# EAGLE design monitor_3 (EAGLE 7.2.0)
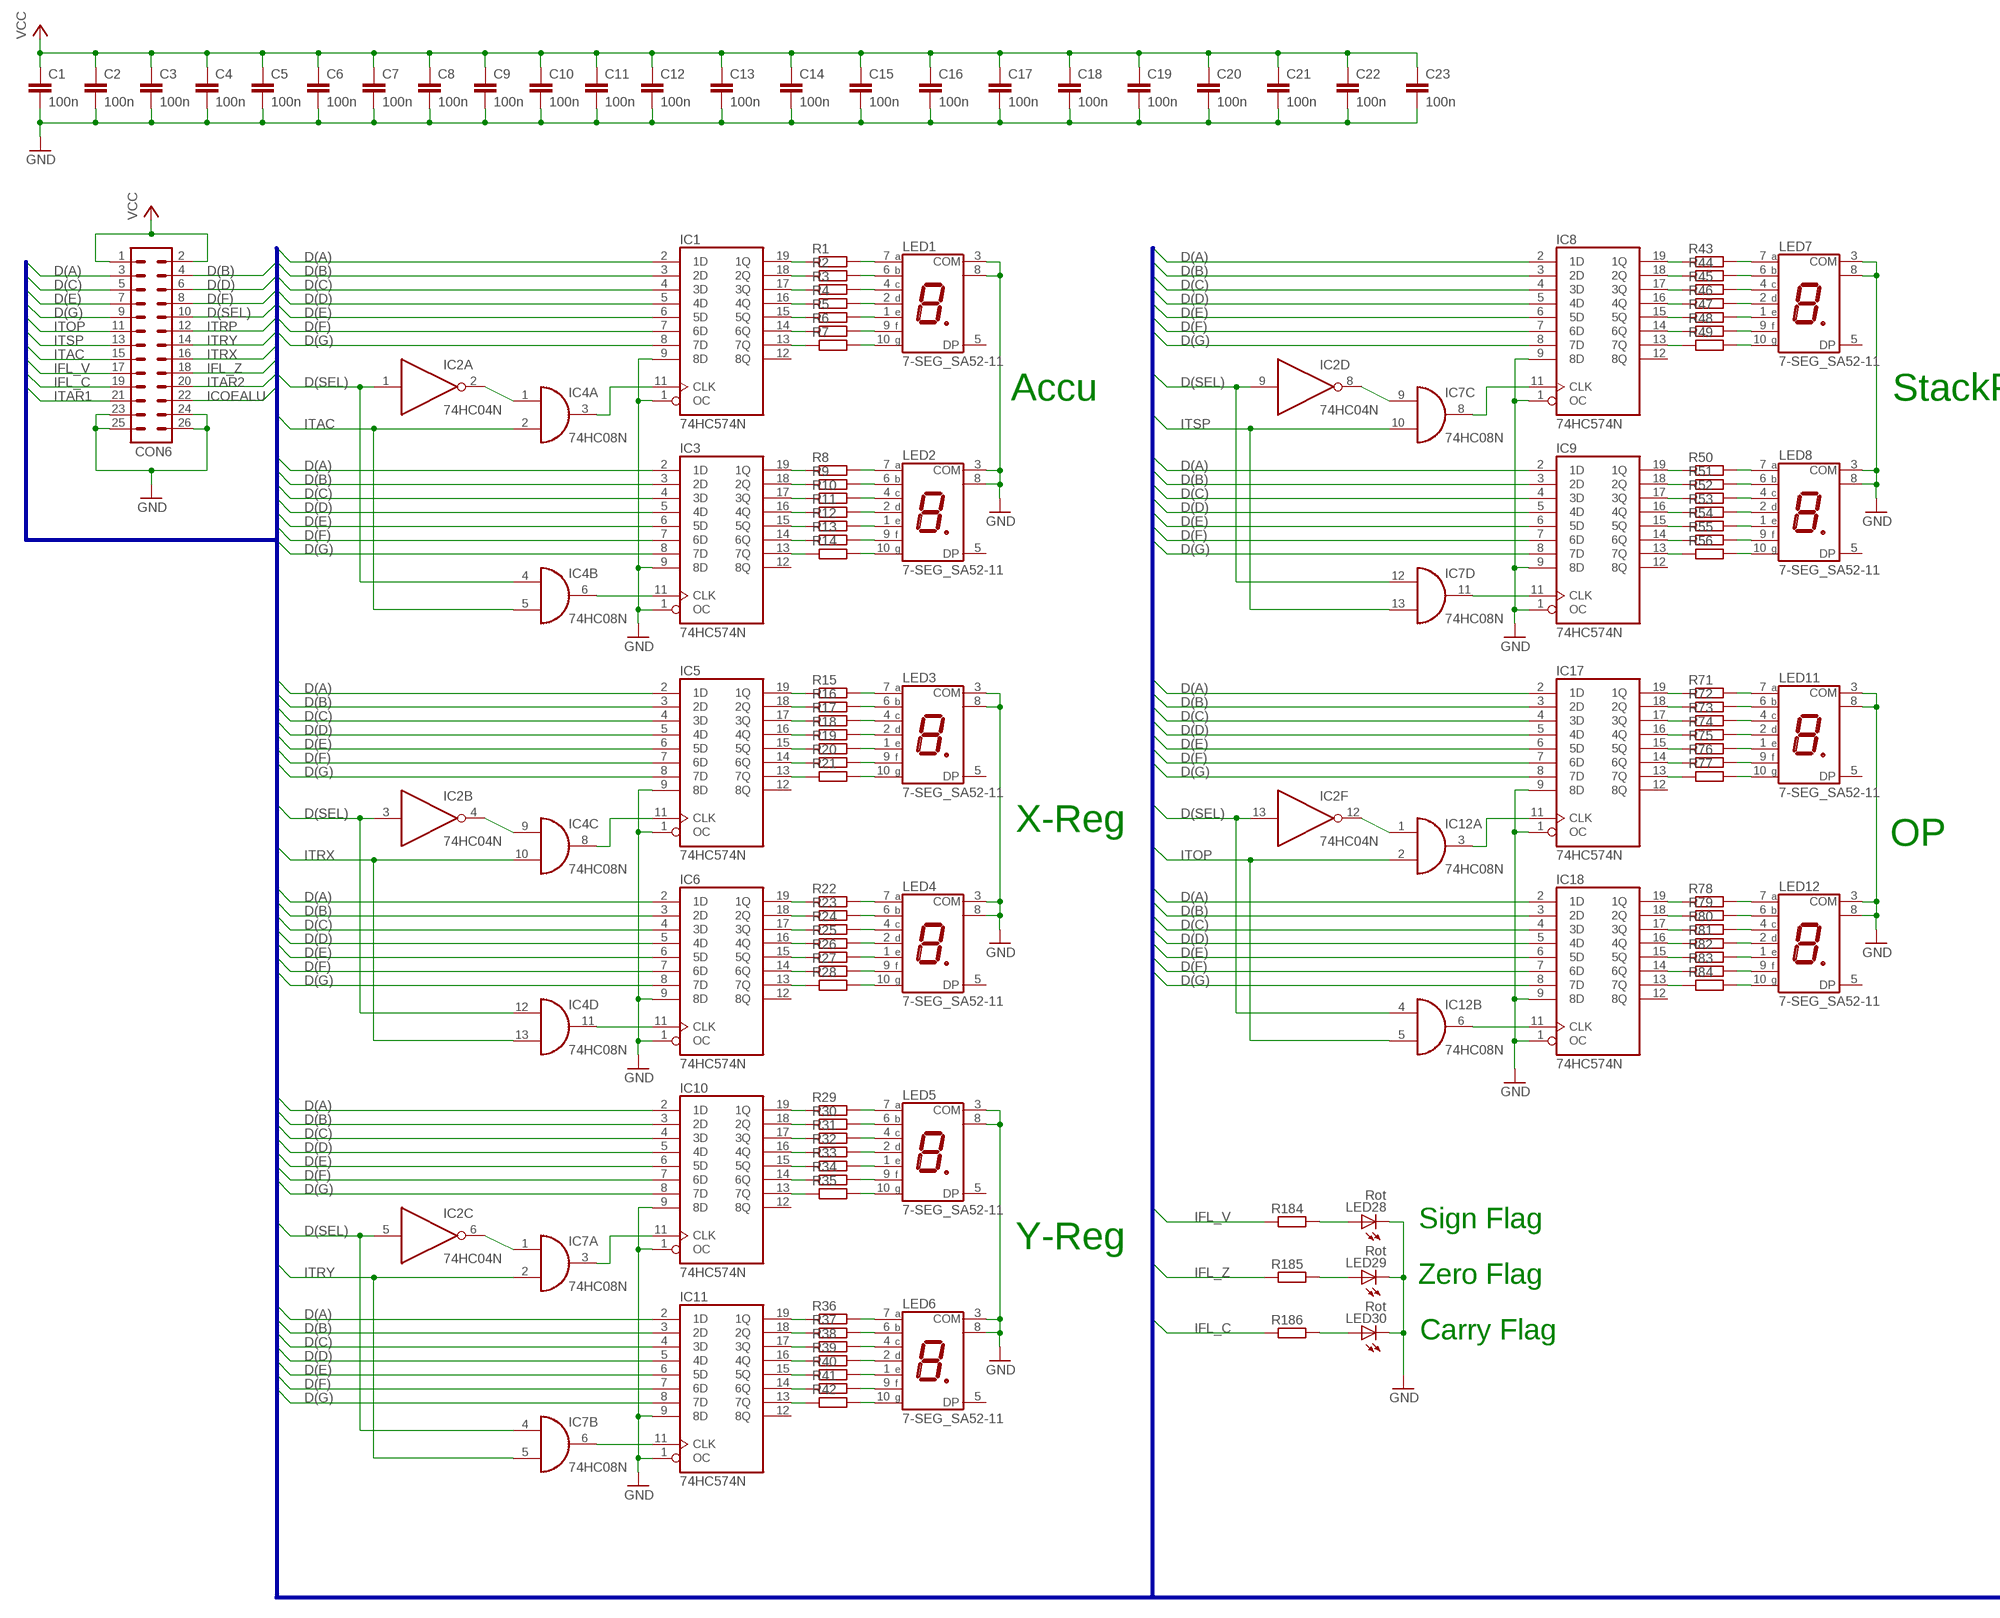
[diagram p0: schematic, sheet 1, part 1 of 2]
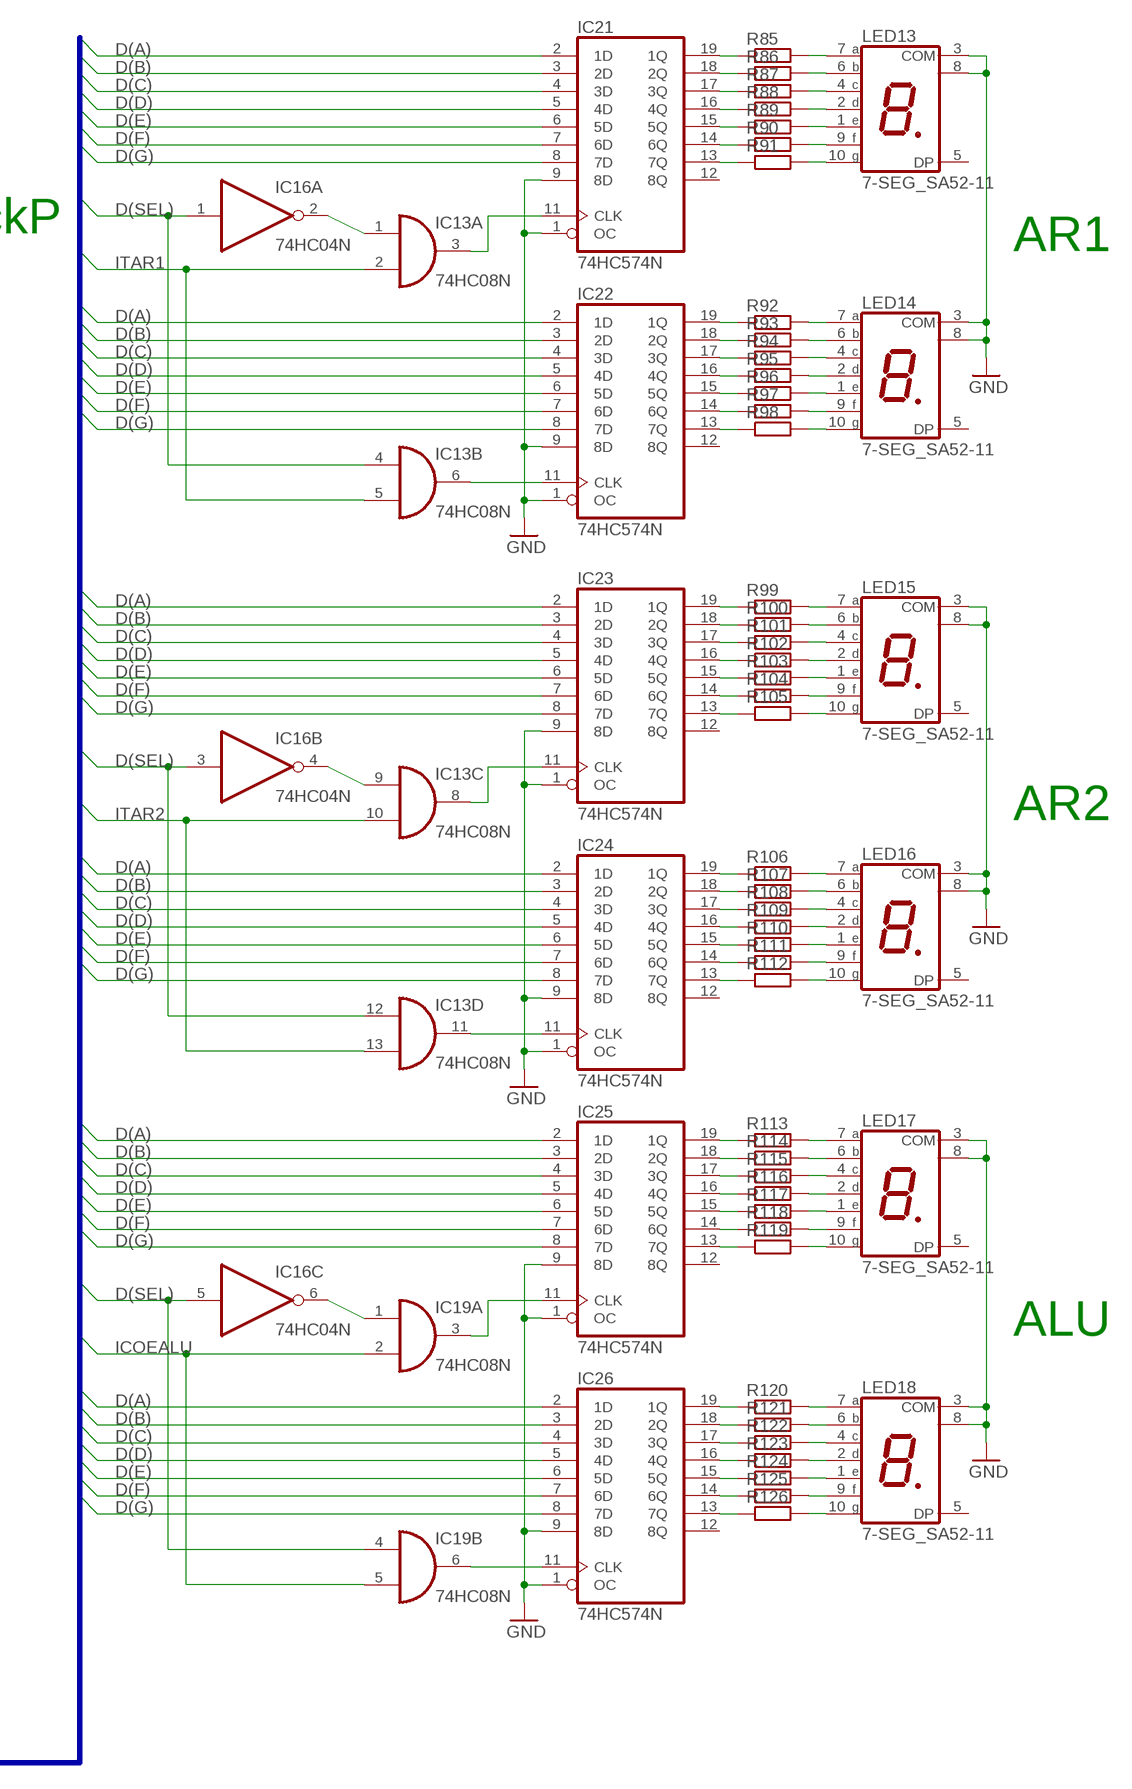
[diagram p1: schematic, sheet 1, part 2 of 2]

## Parts
C1  100n  C-EU025-024X044  [C025-024X044]
C2  100n  C-EU025-024X044  [C025-024X044]
C3  100n  C-EU025-024X044  [C025-024X044]
C4  100n  C-EU025-024X044  [C025-024X044]
C5  100n  C-EU025-024X044  [C025-024X044]
C6  100n  C-EU025-024X044  [C025-024X044]
C7  100n  C-EU025-024X044  [C025-024X044]
C8  100n  C-EU025-024X044  [C025-024X044]
C9  100n  C-EU025-024X044  [C025-024X044]
C10  100n  C-EU025-024X044  [C025-024X044]
C11  100n  C-EU025-024X044  [C025-024X044]
C12  100n  C-EU025-024X044  [C025-024X044]
C13  100n  C-EU025-024X044  [C025-024X044]
C14  100n  C-EU025-024X044  [C025-024X044]
C15  100n  C-EU025-024X044  [C025-024X044]
C16  100n  C-EU025-024X044  [C025-024X044]
C17  100n  C-EU025-024X044  [C025-024X044]
C18  100n  C-EU025-024X044  [C025-024X044]
C19  100n  C-EU025-024X044  [C025-024X044]
C20  100n  C-EU025-024X044  [C025-024X044]
C21  100n  C-EU025-024X044  [C025-024X044]
C22  100n  C-EU025-024X044  [C025-024X044]
C23  100n  C-EU025-024X044  [C025-024X044]
CON6  ML26L  [ML26L]
IC1  74HC574N  [DIL20]
IC2  74HC04N  [DIL14]
IC3  74HC574N  [DIL20]
IC4  74HC08N  [DIL14]
IC5  74HC574N  [DIL20]
IC6  74HC574N  [DIL20]
IC7  74HC08N  [DIL14]
IC8  74HC574N  [DIL20]
IC9  74HC574N  [DIL20]
IC10  74HC574N  [DIL20]
IC11  74HC574N  [DIL20]
IC12  74HC08N  [DIL14]
IC13  74HC08N  [DIL14]
IC16  74HC04N  [DIL14]
IC17  74HC574N  [DIL20]
IC18  74HC574N  [DIL20]
IC19  74HC08N  [DIL14]
IC21  74HC574N  [DIL20]
IC22  74HC574N  [DIL20]
IC23  74HC574N  [DIL20]
IC24  74HC574N  [DIL20]
IC25  74HC574N  [DIL20]
IC26  74HC574N  [DIL20]
LED1  7-SEG_SA52-11  [SA52-11]
LED2  7-SEG_SA52-11  [SA52-11]
LED3  7-SEG_SA52-11  [SA52-11]
LED4  7-SEG_SA52-11  [SA52-11]
LED5  7-SEG_SA52-11  [SA52-11]
LED6  7-SEG_SA52-11  [SA52-11]
LED7  7-SEG_SA52-11  [SA52-11]
LED8  7-SEG_SA52-11  [SA52-11]
LED11  7-SEG_SA52-11  [SA52-11]
LED12  7-SEG_SA52-11  [SA52-11]
LED13  7-SEG_SA52-11  [SA52-11]
LED14  7-SEG_SA52-11  [SA52-11]
LED15  7-SEG_SA52-11  [SA52-11]
LED16  7-SEG_SA52-11  [SA52-11]
LED17  7-SEG_SA52-11  [SA52-11]
LED18  7-SEG_SA52-11  [SA52-11]
LED28  Rot  LED5MM  [LED5MM]
LED29  Rot  LED5MM  [LED5MM]
LED30  Rot  LED5MM  [LED5MM]
R1  R-EU_0207/7  [0207/7]
R2  R-EU_0207/7  [0207/7]
R3  R-EU_0207/7  [0207/7]
R4  R-EU_0207/7  [0207/7]
R5  R-EU_0207/7  [0207/7]
R6  R-EU_0207/7  [0207/7]
R7  R-EU_0207/7  [0207/7]
R8  R-EU_0207/7  [0207/7]
R9  R-EU_0207/7  [0207/7]
R10  R-EU_0207/7  [0207/7]
R11  R-EU_0207/7  [0207/7]
R12  R-EU_0207/7  [0207/7]
R13  R-EU_0207/7  [0207/7]
R14  R-EU_0207/7  [0207/7]
R15  R-EU_0207/7  [0207/7]
R16  R-EU_0207/7  [0207/7]
R17  R-EU_0207/7  [0207/7]
R18  R-EU_0207/7  [0207/7]
R19  R-EU_0207/7  [0207/7]
R20  R-EU_0207/7  [0207/7]
R21  R-EU_0207/7  [0207/7]
R22  R-EU_0207/7  [0207/7]
R23  R-EU_0207/7  [0207/7]
R24  R-EU_0207/7  [0207/7]
R25  R-EU_0207/7  [0207/7]
R26  R-EU_0207/7  [0207/7]
R27  R-EU_0207/7  [0207/7]
R28  R-EU_0207/7  [0207/7]
R29  R-EU_0207/7  [0207/7]
R30  R-EU_0207/7  [0207/7]
R31  R-EU_0207/7  [0207/7]
R32  R-EU_0207/7  [0207/7]
R33  R-EU_0207/7  [0207/7]
R34  R-EU_0207/7  [0207/7]
R35  R-EU_0207/7  [0207/7]
R36  R-EU_0207/7  [0207/7]
R37  R-EU_0207/7  [0207/7]
R38  R-EU_0207/7  [0207/7]
R39  R-EU_0207/7  [0207/7]
R40  R-EU_0207/7  [0207/7]
R41  R-EU_0207/7  [0207/7]
R42  R-EU_0207/7  [0207/7]
R43  R-EU_0207/7  [0207/7]
R44  R-EU_0207/7  [0207/7]
R45  R-EU_0207/7  [0207/7]
R46  R-EU_0207/7  [0207/7]
R47  R-EU_0207/7  [0207/7]
R48  R-EU_0207/7  [0207/7]
R49  R-EU_0207/7  [0207/7]
R50  R-EU_0207/7  [0207/7]
R51  R-EU_0207/7  [0207/7]
R52  R-EU_0207/7  [0207/7]
R53  R-EU_0207/7  [0207/7]
R54  R-EU_0207/7  [0207/7]
R55  R-EU_0207/7  [0207/7]
R56  R-EU_0207/7  [0207/7]
R71  R-EU_0207/7  [0207/7]
R72  R-EU_0207/7  [0207/7]
R73  R-EU_0207/7  [0207/7]
R74  R-EU_0207/7  [0207/7]
R75  R-EU_0207/7  [0207/7]
R76  R-EU_0207/7  [0207/7]
R77  R-EU_0207/7  [0207/7]
R78  R-EU_0207/7  [0207/7]
R79  R-EU_0207/7  [0207/7]
R80  R-EU_0207/7  [0207/7]
R81  R-EU_0207/7  [0207/7]
R82  R-EU_0207/7  [0207/7]
R83  R-EU_0207/7  [0207/7]
R84  R-EU_0207/7  [0207/7]
R85  R-EU_0207/7  [0207/7]
R86  R-EU_0207/7  [0207/7]
R87  R-EU_0207/7  [0207/7]
R88  R-EU_0207/7  [0207/7]
R89  R-EU_0207/7  [0207/7]
R90  R-EU_0207/7  [0207/7]
R91  R-EU_0207/7  [0207/7]
R92  R-EU_0207/7  [0207/7]
R93  R-EU_0207/7  [0207/7]
R94  R-EU_0207/7  [0207/7]
R95  R-EU_0207/7  [0207/7]
R96  R-EU_0207/7  [0207/7]
R97  R-EU_0207/7  [0207/7]
R98  R-EU_0207/7  [0207/7]
R99  R-EU_0207/7  [0207/7]
R100  R-EU_0207/7  [0207/7]
R101  R-EU_0207/7  [0207/7]
R102  R-EU_0207/7  [0207/7]
R103  R-EU_0207/7  [0207/7]
R104  R-EU_0207/7  [0207/7]
R105  R-EU_0207/7  [0207/7]
R106  R-EU_0207/7  [0207/7]
R107  R-EU_0207/7  [0207/7]
R108  R-EU_0207/7  [0207/7]
R109  R-EU_0207/7  [0207/7]
R110  R-EU_0207/7  [0207/7]
R111  R-EU_0207/7  [0207/7]
R112  R-EU_0207/7  [0207/7]
R113  R-EU_0207/7  [0207/7]
R114  R-EU_0207/7  [0207/7]
R115  R-EU_0207/7  [0207/7]
R116  R-EU_0207/7  [0207/7]
R117  R-EU_0207/7  [0207/7]
R118  R-EU_0207/7  [0207/7]
R119  R-EU_0207/7  [0207/7]
R120  R-EU_0207/7  [0207/7]
R121  R-EU_0207/7  [0207/7]
R122  R-EU_0207/7  [0207/7]
R123  R-EU_0207/7  [0207/7]
R124  R-EU_0207/7  [0207/7]
R125  R-EU_0207/7  [0207/7]
R126  R-EU_0207/7  [0207/7]
R184  R-EU_0207/7  [0207/7]
R185  R-EU_0207/7  [0207/7]
R186  R-EU_0207/7  [0207/7]

## Nets
D(A): CON6.3 IC1.2(1D) IC3.2(1D) IC5.2(1D) IC6.2(1D) IC8.2(1D) IC9.2(1D) IC10.2(1D) IC11.2(1D) IC17.2(1D) IC18.2(1D) IC21.2(1D) IC22.2(1D) IC23.2(1D) IC24.2(1D) IC25.2(1D) IC26.2(1D)
D(B): CON6.4 IC1.3(2D) IC3.3(2D) IC5.3(2D) IC6.3(2D) IC8.3(2D) IC9.3(2D) IC10.3(2D) IC11.3(2D) IC17.3(2D) IC18.3(2D) IC21.3(2D) IC22.3(2D) IC23.3(2D) IC24.3(2D) IC25.3(2D) IC26.3(2D)
D(C): CON6.5 IC1.4(3D) IC3.4(3D) IC5.4(3D) IC6.4(3D) IC8.4(3D) IC9.4(3D) IC10.4(3D) IC11.4(3D) IC17.4(3D) IC18.4(3D) IC21.4(3D) IC22.4(3D) IC23.4(3D) IC24.4(3D) IC25.4(3D) IC26.4(3D)
D(D): CON6.6 IC1.5(4D) IC3.5(4D) IC5.5(4D) IC6.5(4D) IC8.5(4D) IC9.5(4D) IC10.5(4D) IC11.5(4D) IC17.5(4D) IC18.5(4D) IC21.5(4D) IC22.5(4D) IC23.5(4D) IC24.5(4D) IC25.5(4D) IC26.5(4D)
D(E): CON6.7 IC1.6(5D) IC3.6(5D) IC5.6(5D) IC6.6(5D) IC8.6(5D) IC9.6(5D) IC10.6(5D) IC11.6(5D) IC17.6(5D) IC18.6(5D) IC21.6(5D) IC22.6(5D) IC23.6(5D) IC24.6(5D) IC25.6(5D) IC26.6(5D)
D(F): CON6.8 IC1.7(6D) IC3.7(6D) IC5.7(6D) IC6.7(6D) IC8.7(6D) IC9.7(6D) IC10.7(6D) IC11.7(6D) IC17.7(6D) IC18.7(6D) IC21.7(6D) IC22.7(6D) IC23.7(6D) IC24.7(6D) IC25.7(6D) IC26.7(6D)
D(G): CON6.9 IC1.8(7D) IC3.8(7D) IC5.8(7D) IC6.8(7D) IC8.8(7D) IC9.8(7D) IC10.8(7D) IC11.8(7D) IC17.8(7D) IC18.8(7D) IC21.8(7D) IC22.8(7D) IC23.8(7D) IC24.8(7D) IC25.8(7D) IC26.8(7D)
D(SEL): CON6.10 IC2.1(A:I) IC2.3(B:I) IC2.5(C:I) IC2.9(D:I) IC2.13(F:I) IC4.4(B:I0) IC4.12(D:I0) IC7.4(B:I0) IC7.12(D:I0) IC12.4(B:I0) IC13.4(B:I0) IC13.12(D:I0) IC16.1(A:I) IC16.3(B:I) IC16.5(C:I) IC19.4(B:I0)
GND: C1.2 C2.2 C3.2 C4.2 C5.2 C6.2 C7.2 C8.2 C9.2 C10.2 C11.2 C12.2 C13.2 C14.2 C15.2 C16.2 C17.2 C18.2 C19.2 C20.2 C21.2 C22.2 C23.2 CON6.23 CON6.24 CON6.25 CON6.26 IC1.1(OC) IC1.9(8D) IC3.1(OC) IC3.9(8D) IC5.1(OC) IC5.9(8D) IC6.1(OC) IC6.9(8D) IC8.1(OC) IC8.9(8D) IC9.1(OC) IC9.9(8D) IC10.1(OC) IC10.9(8D) IC11.1(OC) IC11.9(8D) IC17.1(OC) IC17.9(8D) IC18.1(OC) IC18.9(8D) IC21.1(OC) IC21.9(8D) IC22.1(OC) IC22.9(8D) IC23.1(OC) IC23.9(8D) IC24.1(OC) IC24.9(8D) IC25.1(OC) IC25.9(8D) IC26.1(OC) IC26.9(8D) LED1.3(COM) LED1.8(COM) LED2.3(COM) LED2.8(COM) LED3.3(COM) LED3.8(COM) LED4.3(COM) LED4.8(COM) LED5.3(COM) LED5.8(COM) LED6.3(COM) LED6.8(COM) LED7.3(COM) LED7.8(COM) LED8.3(COM) LED8.8(COM) LED11.3(COM) LED11.8(COM) LED12.3(COM) LED12.8(COM) LED13.3(COM) LED13.8(COM) LED14.3(COM) LED14.8(COM) LED15.3(COM) LED15.8(COM) LED16.3(COM) LED16.8(COM) LED17.3(COM) LED17.8(COM) LED18.3(COM) LED18.8(COM) LED28.K(C) LED29.K(C) LED30.K(C)
ICOEALU: CON6.22 IC19.2(A:I1) IC19.5(B:I1)
IFL_C: CON6.19 R186.1
IFL_V: CON6.17 R184.1
IFL_Z: CON6.18 R185.1
ITAC: CON6.15 IC4.2(A:I1) IC4.5(B:I1)
ITAR1: CON6.21 IC13.2(A:I1) IC13.5(B:I1)
ITAR2: CON6.20 IC13.10(C:I1) IC13.13(D:I1)
ITOP: CON6.11 IC12.2(A:I1) IC12.5(B:I1)
ITRP: CON6.12
ITRX: CON6.16 IC4.10(C:I1) IC4.13(D:I1)
ITRY: CON6.14 IC7.2(A:I1) IC7.5(B:I1)
ITSP: CON6.13 IC7.10(C:I1) IC7.13(D:I1)
N$1: IC2.2(A:O) IC4.1(A:I0)
N$2: IC1.11(CLK) IC4.3(A:O)
N$3: LED1.6(B) R2.2
N$4: IC1.19(1Q) R1.1
N$5: IC1.18(2Q) R2.1
N$6: IC1.17(3Q) R3.1
N$7: IC1.16(4Q) R4.1
N$8: IC1.15(5Q) R5.1
N$9: IC1.14(6Q) R6.1
N$10: IC1.13(7Q) R7.1
N$11: LED1.7(A) R1.2
N$12: LED1.4(C) R3.2
N$13: LED1.2(D) R4.2
N$14: LED1.1(E) R5.2
N$15: LED1.9(F) R6.2
N$16: LED1.10(G) R7.2
N$17: IC3.11(CLK) IC4.6(B:O)
N$18: LED2.6(B) R9.2
N$19: IC3.19(1Q) R8.1
N$20: IC3.18(2Q) R9.1
N$21: IC3.17(3Q) R10.1
N$22: IC3.16(4Q) R11.1
N$23: IC3.15(5Q) R12.1
N$24: IC3.14(6Q) R13.1
N$25: IC3.13(7Q) R14.1
N$26: LED2.7(A) R8.2
N$27: LED2.4(C) R10.2
N$28: LED2.2(D) R11.2
N$29: LED2.1(E) R12.2
N$30: LED2.9(F) R13.2
N$31: LED2.10(G) R14.2
N$32: IC2.4(B:O) IC4.9(C:I0)
N$33: IC4.8(C:O) IC5.11(CLK)
N$34: IC4.11(D:O) IC6.11(CLK)
N$35: LED3.6(B) R16.2
N$36: IC5.19(1Q) R15.1
N$37: IC5.18(2Q) R16.1
N$38: IC5.17(3Q) R17.1
N$39: IC5.16(4Q) R18.1
N$40: IC5.15(5Q) R19.1
N$41: IC5.14(6Q) R20.1
N$42: IC5.13(7Q) R21.1
N$43: LED3.7(A) R15.2
N$44: LED3.4(C) R17.2
N$45: LED3.2(D) R18.2
N$46: LED3.1(E) R19.2
N$47: LED3.9(F) R20.2
N$48: LED3.10(G) R21.2
N$49: IC2.6(C:O) IC7.1(A:I0)
N$50: IC7.3(A:O) IC10.11(CLK)
N$51: IC7.6(B:O) IC11.11(CLK)
N$52: LED7.6(B) R44.2
N$53: IC8.19(1Q) R43.1
N$54: IC8.18(2Q) R44.1
N$55: IC8.17(3Q) R45.1
N$56: IC8.16(4Q) R46.1
N$57: IC8.15(5Q) R47.1
N$58: IC8.14(6Q) R48.1
N$59: IC8.13(7Q) R49.1
N$60: LED7.7(A) R43.2
N$61: LED7.4(C) R45.2
N$62: LED7.2(D) R46.2
N$63: LED7.1(E) R47.2
N$64: LED7.9(F) R48.2
N$65: LED7.10(G) R49.2
N$66: IC2.8(D:O) IC7.9(C:I0)
N$67: IC7.8(C:O) IC8.11(CLK)
N$68: IC7.11(D:O) IC9.11(CLK)
N$69: LED8.6(B) R51.2
N$70: IC9.19(1Q) R50.1
N$71: IC9.18(2Q) R51.1
N$72: IC9.17(3Q) R52.1
N$73: IC9.16(4Q) R53.1
N$74: IC9.15(5Q) R54.1
N$75: IC9.14(6Q) R55.1
N$76: IC9.13(7Q) R56.1
N$77: LED8.7(A) R50.2
N$78: LED8.4(C) R52.2
N$79: LED8.2(D) R53.2
N$80: LED8.1(E) R54.2
N$81: LED8.9(F) R55.2
N$82: LED8.10(G) R56.2
N$100: IC2.12(F:O) IC12.1(A:I0)
N$101: IC12.3(A:O) IC17.11(CLK)
N$102: IC12.6(B:O) IC18.11(CLK)
N$103: LED13.6(B) R86.2
N$104: IC21.19(1Q) R85.1
N$105: IC21.18(2Q) R86.1
N$106: IC21.17(3Q) R87.1
N$107: IC21.16(4Q) R88.1
N$108: IC21.15(5Q) R89.1
N$109: IC21.14(6Q) R90.1
N$110: IC21.13(7Q) R91.1
N$111: LED13.7(A) R85.2
N$112: LED13.4(C) R87.2
N$113: LED13.2(D) R88.2
N$114: LED13.1(E) R89.2
N$115: LED13.9(F) R90.2
N$116: LED13.10(G) R91.2
N$117: IC13.1(A:I0) IC16.2(A:O)
N$118: IC13.3(A:O) IC21.11(CLK)
N$119: IC13.6(B:O) IC22.11(CLK)
N$120: LED14.6(B) R93.2
N$121: IC22.19(1Q) R92.1
N$122: IC22.18(2Q) R93.1
N$123: IC22.17(3Q) R94.1
N$124: IC22.16(4Q) R95.1
N$125: IC22.15(5Q) R96.1
N$126: IC22.14(6Q) R97.1
N$127: IC22.13(7Q) R98.1
N$128: LED14.7(A) R92.2
N$129: LED14.4(C) R94.2
N$130: LED14.2(D) R95.2
N$131: LED14.1(E) R96.2
N$132: LED14.9(F) R97.2
N$133: LED14.10(G) R98.2
N$134: IC13.9(C:I0) IC16.4(B:O)
N$135: IC13.8(C:O) IC23.11(CLK)
N$136: IC13.11(D:O) IC24.11(CLK)
N$137: LED15.6(B) R100.2
N$138: IC23.19(1Q) R99.1
N$139: IC23.18(2Q) R100.1
N$140: IC23.17(3Q) R101.1
N$141: IC23.16(4Q) R102.1
N$142: IC23.15(5Q) R103.1
N$143: IC23.14(6Q) R104.1
N$144: IC23.13(7Q) R105.1
N$145: LED15.7(A) R99.2
N$146: LED15.4(C) R101.2
N$147: LED15.2(D) R102.2
N$148: LED15.1(E) R103.2
N$149: LED15.9(F) R104.2
N$150: LED15.10(G) R105.2
N$151: IC16.6(C:O) IC19.1(A:I0)
N$152: IC19.3(A:O) IC25.11(CLK)
N$153: IC19.6(B:O) IC26.11(CLK)
N$154: LED4.6(B) R23.2
N$155: IC6.19(1Q) R22.1
N$156: IC6.18(2Q) R23.1
N$157: IC6.17(3Q) R24.1
N$158: IC6.16(4Q) R25.1
N$159: IC6.15(5Q) R26.1
N$160: IC6.14(6Q) R27.1
N$161: IC6.13(7Q) R28.1
N$162: LED4.7(A) R22.2
N$163: LED4.4(C) R24.2
N$164: LED4.2(D) R25.2
N$165: LED4.1(E) R26.2
N$166: LED4.9(F) R27.2
N$167: LED4.10(G) R28.2
N$168: LED5.6(B) R30.2
N$169: IC10.19(1Q) R29.1
N$170: IC10.18(2Q) R30.1
N$171: IC10.17(3Q) R31.1
N$172: IC10.16(4Q) R32.1
N$173: IC10.15(5Q) R33.1
N$174: IC10.14(6Q) R34.1
N$175: IC10.13(7Q) R35.1
N$176: LED5.7(A) R29.2
N$177: LED5.4(C) R31.2
N$178: LED5.2(D) R32.2
N$179: LED5.1(E) R33.2
N$180: LED5.9(F) R34.2
N$181: LED5.10(G) R35.2
N$182: LED6.6(B) R37.2
N$183: IC11.19(1Q) R36.1
N$184: IC11.18(2Q) R37.1
N$185: IC11.17(3Q) R38.1
N$186: IC11.16(4Q) R39.1
N$187: IC11.15(5Q) R40.1
N$188: IC11.14(6Q) R41.1
N$189: IC11.13(7Q) R42.1
N$190: LED6.7(A) R36.2
N$191: LED6.4(C) R38.2
N$192: LED6.2(D) R39.2
N$193: LED6.1(E) R40.2
N$194: LED6.9(F) R41.2
N$195: LED6.10(G) R42.2
N$210: LED11.6(B) R72.2
N$211: IC17.19(1Q) R71.1
N$212: IC17.18(2Q) R72.1
N$213: IC17.17(3Q) R73.1
N$214: IC17.16(4Q) R74.1
N$215: IC17.15(5Q) R75.1
N$216: IC17.14(6Q) R76.1
N$217: IC17.13(7Q) R77.1
N$218: LED11.7(A) R71.2
N$219: LED11.4(C) R73.2
N$220: LED11.2(D) R74.2
N$221: LED11.1(E) R75.2
N$222: LED11.9(F) R76.2
N$223: LED11.10(G) R77.2
N$224: LED12.6(B) R79.2
N$225: IC18.19(1Q) R78.1
N$226: IC18.18(2Q) R79.1
N$227: IC18.17(3Q) R80.1
N$228: IC18.16(4Q) R81.1
N$229: IC18.15(5Q) R82.1
N$230: IC18.14(6Q) R83.1
N$231: IC18.13(7Q) R84.1
N$232: LED12.7(A) R78.2
N$233: LED12.4(C) R80.2
N$234: LED12.2(D) R81.2
N$235: LED12.1(E) R82.2
N$236: LED12.9(F) R83.2
N$237: LED12.10(G) R84.2
N$238: LED16.6(B) R107.2
N$239: IC24.19(1Q) R106.1
N$240: IC24.18(2Q) R107.1
N$241: IC24.17(3Q) R108.1
N$242: IC24.16(4Q) R109.1
N$243: IC24.15(5Q) R110.1
N$244: IC24.14(6Q) R111.1
N$245: IC24.13(7Q) R112.1
N$246: LED16.7(A) R106.2
N$247: LED16.4(C) R108.2
N$248: LED16.2(D) R109.2
N$249: LED16.1(E) R110.2
N$250: LED16.9(F) R111.2
N$251: LED16.10(G) R112.2
N$252: LED17.6(B) R114.2
N$253: IC25.19(1Q) R113.1
N$254: IC25.18(2Q) R114.1
N$255: IC25.17(3Q) R115.1
N$256: IC25.16(4Q) R116.1
N$257: IC25.15(5Q) R117.1
N$258: IC25.14(6Q) R118.1
N$259: IC25.13(7Q) R119.1
N$260: LED17.7(A) R113.2
N$261: LED17.4(C) R115.2
N$262: LED17.2(D) R116.2
N$263: LED17.1(E) R117.2
N$264: LED17.9(F) R118.2
N$265: LED17.10(G) R119.2
N$266: LED18.6(B) R121.2
N$267: IC26.19(1Q) R120.1
N$268: IC26.18(2Q) R121.1
N$269: IC26.17(3Q) R122.1
N$270: IC26.16(4Q) R123.1
N$271: IC26.15(5Q) R124.1
N$272: IC26.14(6Q) R125.1
N$273: IC26.13(7Q) R126.1
N$274: LED18.7(A) R120.2
N$275: LED18.4(C) R122.2
N$276: LED18.2(D) R123.2
N$277: LED18.1(E) R124.2
N$278: LED18.9(F) R125.2
N$279: LED18.10(G) R126.2
N$406: LED28.A R184.2
N$407: LED29.A R185.2
N$408: LED30.A R186.2
VCC: C1.1 C2.1 C3.1 C4.1 C5.1 C6.1 C7.1 C8.1 C9.1 C10.1 C11.1 C12.1 C13.1 C14.1 C15.1 C16.1 C17.1 C18.1 C19.1 C20.1 C21.1 C22.1 C23.1 CON6.1 CON6.2
Unconnected: IC1.12(8Q) IC2.10(E:O) IC2.11(E:I) IC3.12(8Q) IC5.12(8Q) IC6.12(8Q) IC8.12(8Q) IC9.12(8Q) IC10.12(8Q) IC11.12(8Q) IC12.8(C:O) IC12.9(C:I0) IC12.10(C:I1) IC12.11(D:O) IC12.12(D:I0) IC12.13(D:I1) IC16.8(D:O) IC16.9(D:I) IC16.10(E:O) IC16.11(E:I) IC16.12(F:O) IC16.13(F:I) IC17.12(8Q) IC18.12(8Q) IC19.8(C:O) IC19.9(C:I0) IC19.10(C:I1) IC19.11(D:O) IC19.12(D:I0) IC19.13(D:I1) IC21.12(8Q) IC22.12(8Q) IC23.12(8Q) IC24.12(8Q) IC25.12(8Q) IC26.12(8Q) LED1.5(DP) LED2.5(DP) LED3.5(DP) LED4.5(DP) LED5.5(DP) LED6.5(DP) LED7.5(DP) LED8.5(DP) LED11.5(DP) LED12.5(DP) LED13.5(DP) LED14.5(DP) LED15.5(DP) LED16.5(DP) LED17.5(DP) LED18.5(DP)

## Buses
D(A),D(B),D(C),D(D),D(E),D(F),D(G),D(SEL),ITOP,ITRP,ITSP,ITRY,ITAC,ITRX,IFL_V,IFL_Z,IFL_C,ITAR2,ITAR1,ICOEALU

## Notes on the sheet
- Accu | StackP
- AR1
- X-Reg
- OP
- AR2
- Sign Flag
- Y-Reg
- ALU
- Zero Flag
- Carry Flag

## Power pins joined to a net without a drawn wire
GND: IC1.10(GND) IC2.7(P:GND) IC3.10(GND) IC4.7(P:GND) IC5.10(GND) IC6.10(GND) IC7.7(P:GND) IC8.10(GND) IC9.10(GND) IC10.10(GND) IC11.10(GND) IC12.7(P:GND) IC13.7(P:GND) IC16.7(P:GND) IC17.10(GND) IC18.10(GND) IC19.7(P:GND) IC21.10(GND) IC22.10(GND) IC23.10(GND) IC24.10(GND) IC25.10(GND) IC26.10(GND)
VCC: IC1.20(VCC) IC2.14(P:VCC) IC3.20(VCC) IC4.14(P:VCC) IC5.20(VCC) IC6.20(VCC) IC7.14(P:VCC) IC8.20(VCC) IC9.20(VCC) IC10.20(VCC) IC11.20(VCC) IC12.14(P:VCC) IC13.14(P:VCC) IC16.14(P:VCC) IC17.20(VCC) IC18.20(VCC) IC19.14(P:VCC) IC21.20(VCC) IC22.20(VCC) IC23.20(VCC) IC24.20(VCC) IC25.20(VCC) IC26.20(VCC)

## Library data of the parts
C1-C23 = resistor:C-EU: CAPACITOR, European symbol
CON6 = con-ml:ML26L: HARTING; OC_FARNELL: unknown; OC_NEWARK: unknown
IC1 IC3 IC5 IC6 IC8-IC11 IC17 IC18 IC21-IC26 = 74xx-eu:74*574: 8-bit D type FLIP FLOP bus driver
IC2 IC16 = 74xx-eu:74*04: Hex INVERTER
IC4 IC7 IC12 IC13 IC19 = 74xx-eu:74*08: Quad 2-input AND gate
LED1-LED8 LED11-LED18 = display-kingbright:7-SEG_: Kingbright 14.2mm (0.56 INCH) SINGLE DIGIT NUMERIC DUISPLAY Source: SA56-11EWA(Ver1189471036.pdf; OC_FARNELL: unknown; OC_NEWARK: unknown
LED28-LED30 = led:LED: LED OSRAM: - CHIPLED LG R971, LG N971, LY N971, LG Q971, LY Q971, LO R971, LY R971 LH N974, LH R974 LS Q976, LO Q976, LY Q976 LO Q996 - Hyper CHIPLED LW Q18S LB Q993, LB Q99A, LB R99A - SideLED LS A670, LO A670, LY A670, LG A670, LP A670 LB A673, LV A673, LT A673, LW A673 LH A674 LY A675 LS A676, LA A676, LO A676, LY A676, LW A676 LS A679, LY A679, LG A679 - Hyper Micro SIDELED® LS Y876, LA Y876, LO Y876, LY Y876 LT Y87S - SmartLED LW L88C, LW L88S LB L89C, LB L89S, LG L890 LS L89K, LO L89K, LY L89K LS L896, LA L896, LO L896, LY L896 - TOPLED LS T670, LO T670, LY T670, LG T670, LP T670 LSG T670, LSP T670, LSY T670, LOP T670, LYG T670 LG T671, LOG T671, LSG T671 LB T673, LV T673, LT T673, LW T673 LH T674 LS T676, LA T676, LO T676, LY T676, LB T676, LH T676, LSB T676, LW T676 LB T67C, LV T67C, LT T67C, LS T67K, LO T67K, LY T67K, LW E67C LS E67B, LA E67B, LO E67B, LY E67B, LB E67C, LV E67C, LT E67C LW T67C LS T679, LY T679, LG T679 LS T770, LO T770, LY T770, LG T770, LP T770 LB T773, LV T773, LT T773, LW T773 LH T774 LS E675, LA E675, LY E675, LS T675 LS T776, LA T776, LO T776, LY T776, LB T776 LHGB T686 LT T68C, LB T68C - Hyper Mini TOPLED® LB M676 - Mini TOPLED Santana® LG M470 LS M47K, LO M47K, LY M47K Source: http://www.osram.convergy.de LUXEON: - LUMILED® LXK2-PW12-R00, LXK2-PW12-S00, LXK2-PW14-U00, LXK2-PW14-V00 LXK2-PM12-R00, LXK2-PM12-S00, LXK2-PM14-U00 LXK2-PE12-Q00, LXK2-PE12-R00, LXK2-PE12-S00, LXK2-PE14-T00, LXK2-PE14-U00 LXK2-PB12-K00, LXK2-PB12-L00, LXK2-PB12-M00, LXK2-PB14-N00, LXK2-PB14-P00, LXK2-PB14-Q00 LXK2-PR12-L00, LXK2-PR12-M00, LXK2-PR14-Q00, LXK2-PR14-R00 LXK2-PD12-Q00, LXK2-PD12-R00, LXK2-PD12-S00 LXK2-PH12-R00, LXK2-PH12-S00 LXK2-PL12-P00, LXK2-PL12-Q00, LXK2-PL12-R00 Source: www.luxeon.com KINGBRIGHT: KA-3528ASYC Source: www.kingbright.com
R1-R56 R71-R126 R184-R186 = resistor:R-EU_: RESISTOR, European symbol

## Board
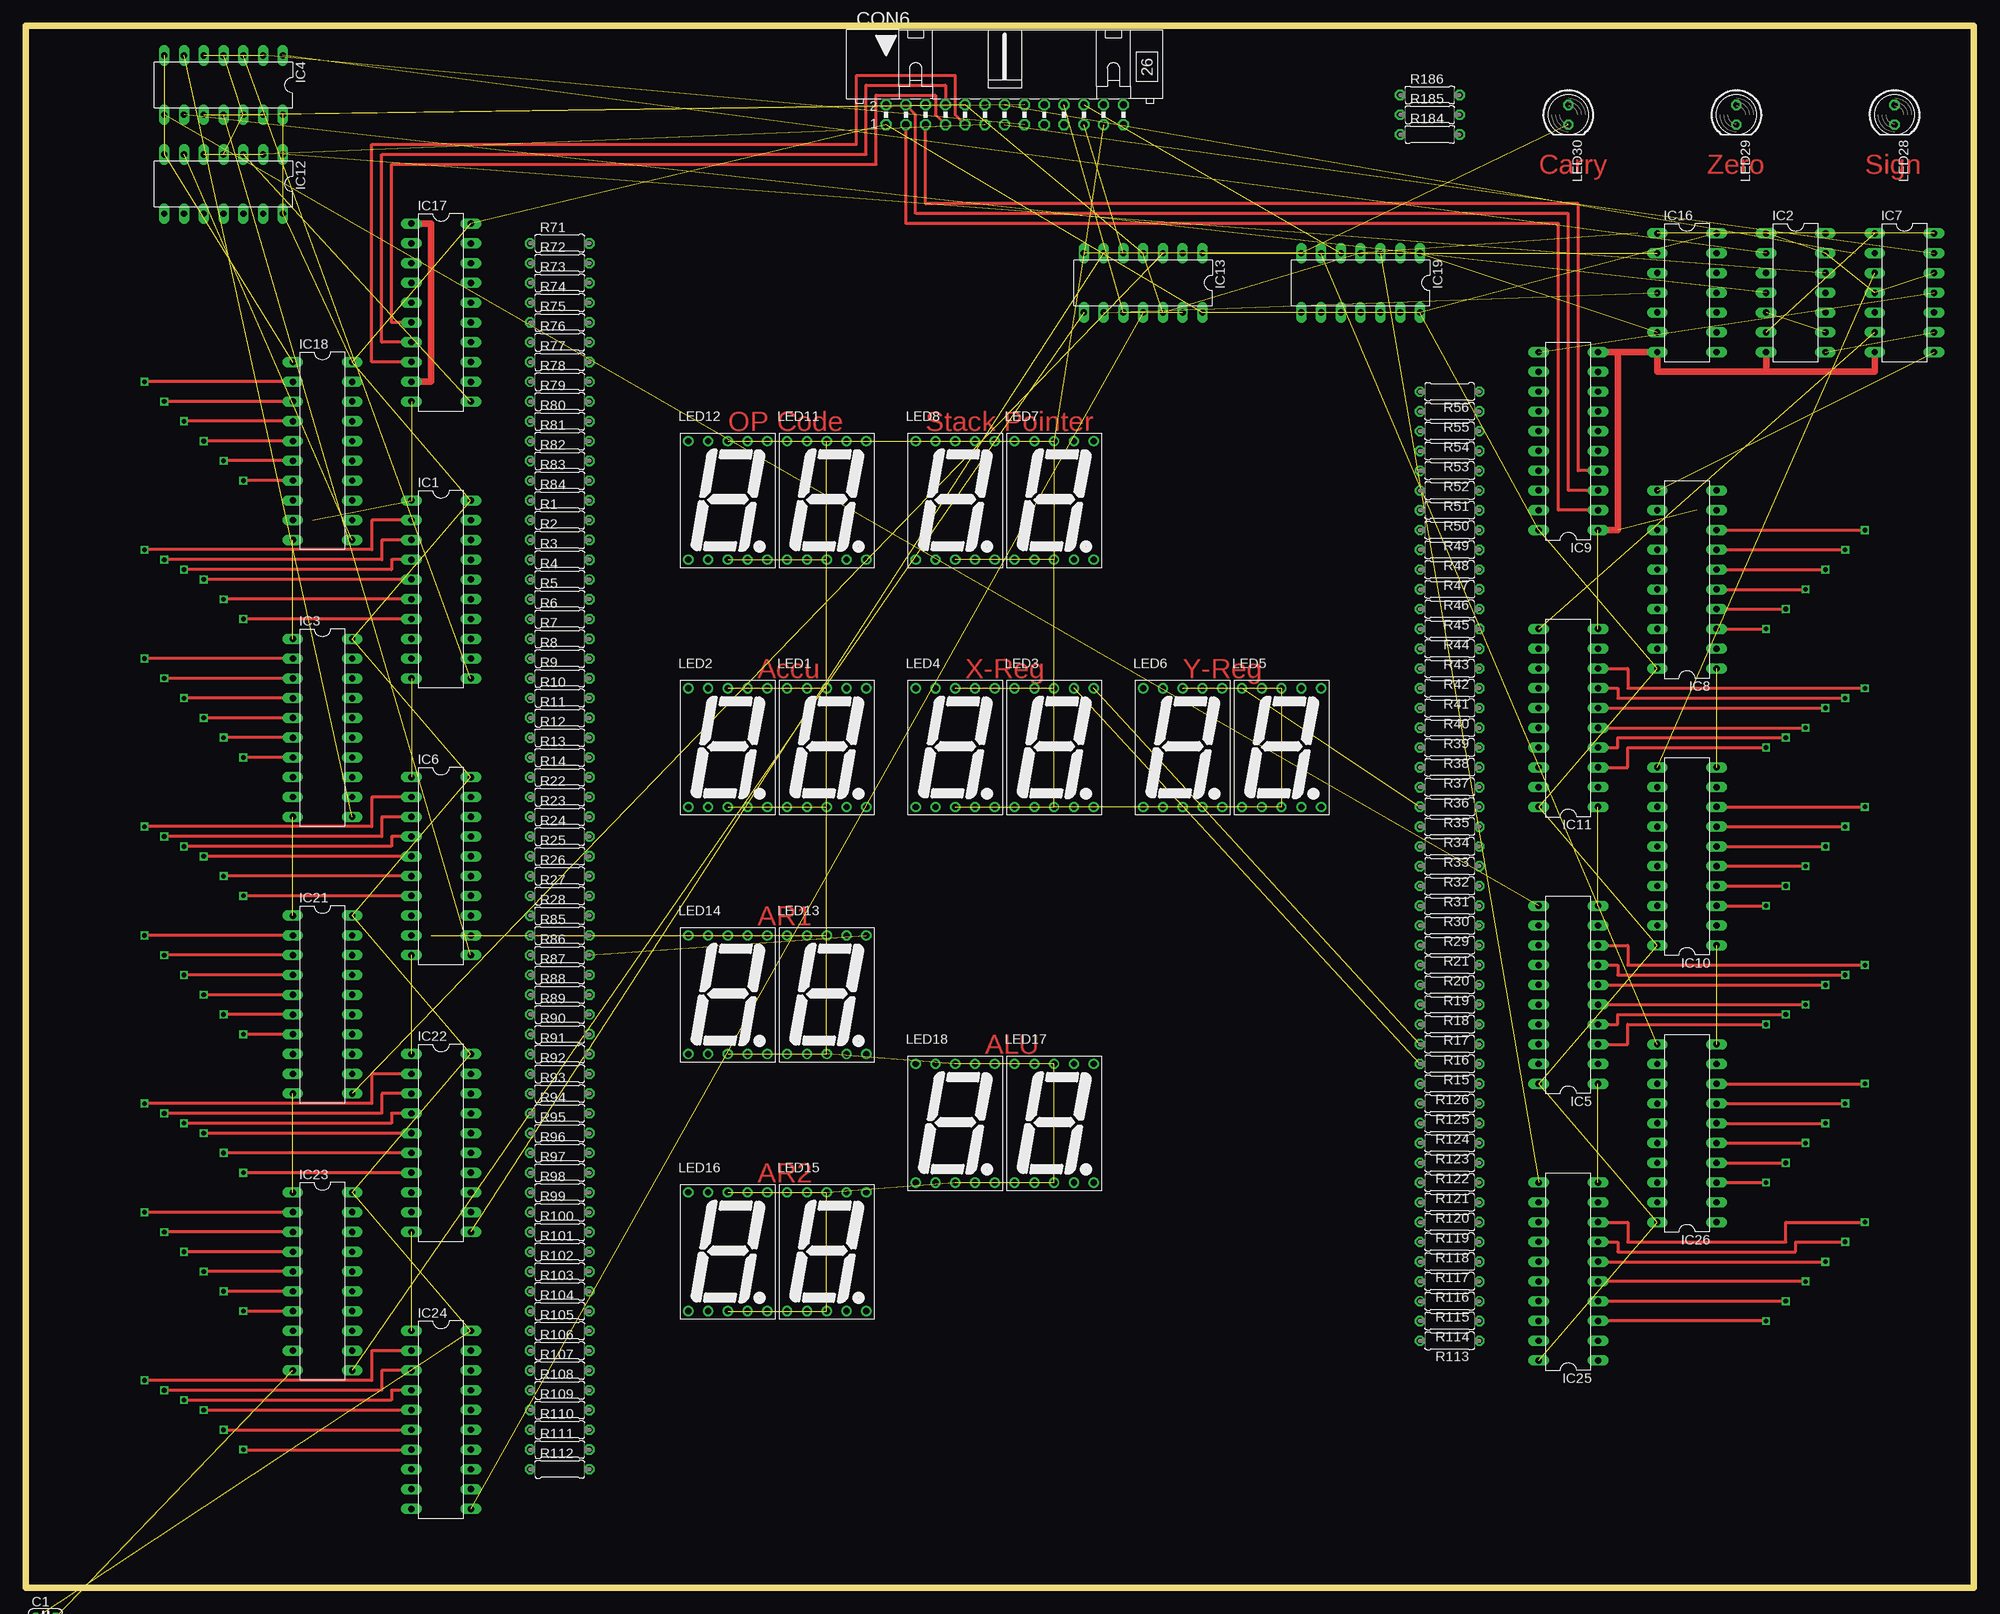
[diagram p2: board, top side]
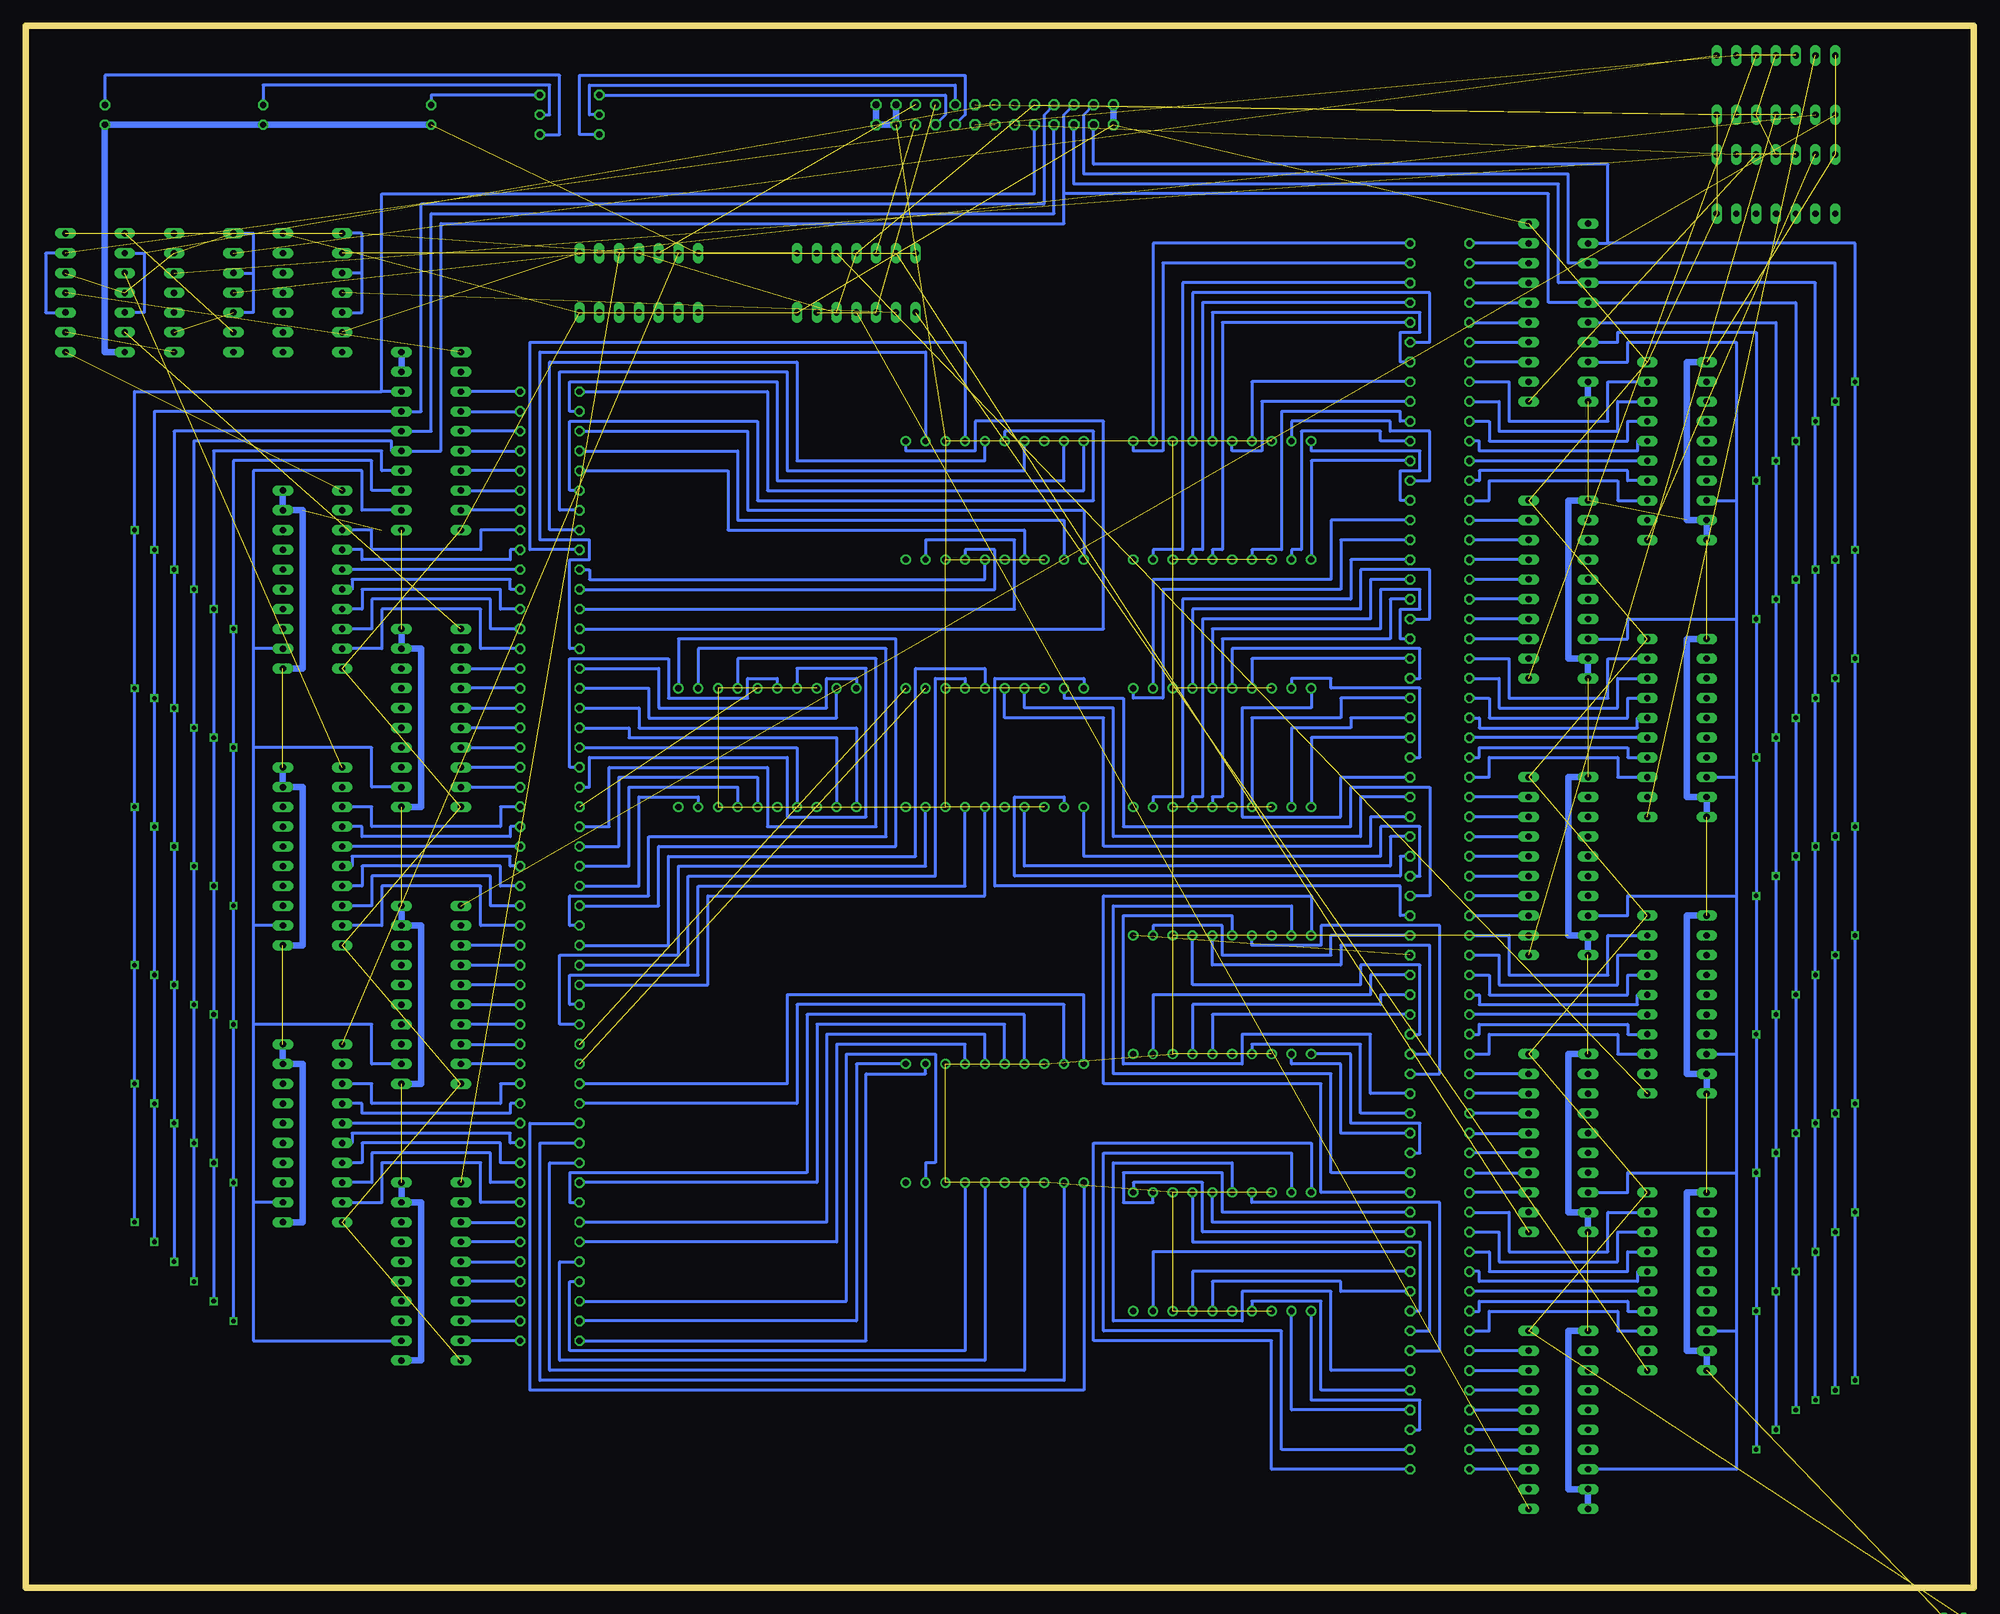
[diagram p3: board, bottom side, seen from below]

Size 250.19 x 200.66 mm. Coordinates in mm from the lower left corner, seen from the top.
Outline: 0,0 250.19,0 250.19,200.66 0,200.66 0,0
Copper layers (1*16): Top 0.035mm / dielectric 1.5mm / Bottom 0.035mm
Design rules "default": minimum track width 10mil, minimum drill 24mil, track to track 8mil, track to pad 8mil, pad to pad 8mil, via to via 8mil, smd to smd 8mil, copper to edge 40mil, drill to drill 8mil, minimum pad ring 10mil, minimum via ring 8mil, stop-mask expansion 4mil, vias tented up to drill 0mil, thermal gap 10mil

### Footprints (pad centres in the part's own frame; a part is rotated, then mirrored left to right if it is on the bottom)
C025-024X044 = drill 0.813 octagon: 1 -1.27,0; 2 1.27,0
ML26L = drill 0.914 octagon: 1 -15.24,-1.27; 2 -15.24,1.27; 3 -12.7,-1.27; 4 -12.7,1.27; 5 -10.16,-1.27; 6 -10.16,1.27; 7 -7.62,-1.27; 8 -7.62,1.27; 9 -5.08,-1.27; 10 -5.08,1.27; 11 -2.54,-1.27; 12 -2.54,1.27; 13 0,-1.27; 14 0,1.27; 15 2.54,-1.27; 16 2.54,1.27; 17 5.08,-1.27; 18 5.08,1.27; 19 7.62,-1.27; 20 7.62,1.27; 21 10.16,-1.27; 22 10.16,1.27; 23 12.7,-1.27; 24 12.7,1.27; 25 15.24,-1.27; 26 15.24,1.27
DIL20 = drill 0.813 long: 1 -11.43,-3.81; 2 -8.89,-3.81; 3 -6.35,-3.81; 4 -3.81,-3.81; 5 -1.27,-3.81; 6 1.27,-3.81; 7 3.81,-3.81; 8 6.35,-3.81; 9 8.89,-3.81; 10 11.43,-3.81; 11 11.43,3.81; 12 8.89,3.81; 13 6.35,3.81; 14 3.81,3.81; 15 1.27,3.81; 16 -1.27,3.81; 17 -3.81,3.81; 18 -6.35,3.81; 19 -8.89,3.81; 20 -11.43,3.81
DIL14 = drill 0.813 long: 1 -7.62,-3.81; 2 -5.08,-3.81; 3 -2.54,-3.81; 4 0,-3.81; 5 2.54,-3.81; 6 5.08,-3.81; 7 7.62,-3.81; 8 7.62,3.81; 9 5.08,3.81; 10 2.54,3.81; 11 0,3.81; 12 -2.54,3.81; 13 -5.08,3.81; 14 -7.62,3.81
SA52-11 = drill 0.8: 1 -5.08,-7.62; 2 -2.54,-7.62; 3 0,-7.62; 4 2.54,-7.62; 5 5.08,-7.62; 6 5.08,7.62; 7 2.54,7.62; 8 0,7.62; 9 -2.54,7.62; 10 -5.08,7.62
LED5MM = drill 0.813 octagon: A -1.27,0; K 1.27,0
0207/7 = drill 0.813 octagon: 1 -3.81,0; 2 3.81,0

### Placement (x,y rotation side)
C1  2.54,-3.81 0 top  (outside the outline)
C2  2.54,-10.16 0 top  (outside the outline)
C3  2.54,-16.51 0 top  (outside the outline)
C4  2.54,-22.86 0 top  (outside the outline)
C5  2.54,-29.21 0 top  (outside the outline)
C6  2.54,-35.56 0 top  (outside the outline)
C7  2.54,-41.91 0 top  (outside the outline)
C8  2.54,-48.26 0 top  (outside the outline)
C9  2.54,-54.61 0 top  (outside the outline)
C10  2.54,-60.96 0 top  (outside the outline)
C11  2.54,-67.31 0 top  (outside the outline)
C12  2.54,-73.66 0 top  (outside the outline)
C13  2.54,-80.01 0 top  (outside the outline)
C14  2.54,-86.36 0 top  (outside the outline)
C15  2.54,-92.71 0 top  (outside the outline)
C16  2.54,-99.06 0 top  (outside the outline)
C17  2.54,-105.41 0 top  (outside the outline)
C18  2.54,-111.76 0 top  (outside the outline)
C19  2.54,-118.11 0 top  (outside the outline)
C20  2.54,-124.46 0 top  (outside the outline)
C21  2.54,-130.81 0 top  (outside the outline)
C22  2.54,-137.16 0 top  (outside the outline)
C23  2.54,-143.51 0 top  (outside the outline)
CON6  125.73,189.23 0 top
IC1  53.34,128.27 270 top
IC2  227.33,166.37 270 top
IC3  38.1,110.49 270 top
IC4  25.4,193.04 180 top
IC5  198.12,76.2 90 top
IC6  53.34,92.71 270 top
IC7  241.3,166.37 270 top
IC8  213.36,129.54 90 top
IC9  198.12,147.32 90 top
IC10  213.36,93.98 90 top
IC11  198.12,111.76 90 top
IC12  25.4,180.34 180 top
IC13  143.51,167.64 180 top
IC16  213.36,166.37 270 top
IC17  53.34,163.83 270 top
IC18  38.1,146.05 270 top
IC19  171.45,167.64 180 top
IC21  38.1,74.93 270 top
IC22  53.34,57.15 270 top
IC23  38.1,39.37 270 top
IC24  53.34,21.59 270 top
IC25  198.12,40.64 90 top
IC26  213.36,58.42 90 top
LED1  102.87,107.95 0 top
LED2  90.17,107.95 0 top
LED3  132.08,107.95 0 top
LED4  119.38,107.95 0 top
LED5  161.29,107.95 0 top
LED6  148.59,107.95 0 top
LED7  132.08,139.7 0 top
LED8  119.38,139.7 0 top
LED11  102.87,139.7 0 top
LED12  90.17,139.7 0 top
LED13  102.87,76.2 0 top
LED14  90.17,76.2 0 top
LED15  102.87,43.18 0 top
LED16  90.17,43.18 0 top
LED17  132.08,59.69 0 top
LED18  119.38,59.69 0 top
LED28  240.03,189.23 270 top
LED29  219.71,189.23 270 top
LED30  198.12,189.23 270 top
R1  68.58,137.16 0 top
R2  68.58,134.62 0 top
R3  68.58,132.08 0 top
R4  68.58,129.54 0 top
R5  68.58,127 0 top
R6  68.58,124.46 0 top
R7  68.58,121.92 0 top
R8  68.58,119.38 0 top
R9  68.58,116.84 0 top
R10  68.58,114.3 0 top
R11  68.58,111.76 0 top
R12  68.58,109.22 0 top
R13  68.58,106.68 0 top
R14  68.58,104.14 0 top
R15  182.88,67.31 180 top
R16  182.88,69.85 180 top
R17  182.88,72.39 180 top
R18  182.88,74.93 180 top
R19  182.88,77.47 180 top
R20  182.88,80.01 180 top
R21  182.88,82.55 180 top
R22  68.58,101.6 0 top
R23  68.58,99.06 0 top
R24  68.58,96.52 0 top
R25  68.58,93.98 0 top
R26  68.58,91.44 0 top
R27  68.58,88.9 0 top
R28  68.58,86.36 0 top
R29  182.88,85.09 180 top
R30  182.88,87.63 180 top
R31  182.88,90.17 180 top
R32  182.88,92.71 180 top
R33  182.88,95.25 180 top
R34  182.88,97.79 180 top
R35  182.88,100.33 180 top
R36  182.88,102.87 180 top
R37  182.88,105.41 180 top
R38  182.88,107.95 180 top
R39  182.88,110.49 180 top
R40  182.88,113.03 180 top
R41  182.88,115.57 180 top
R42  182.88,118.11 180 top
R43  182.88,120.65 180 top
R44  182.88,123.19 180 top
R45  182.88,125.73 180 top
R46  182.88,128.27 180 top
R47  182.88,130.81 180 top
R48  182.88,133.35 180 top
R49  182.88,135.89 180 top
R50  182.88,138.43 180 top
R51  182.88,140.97 180 top
R52  182.88,143.51 180 top
R53  182.88,146.05 180 top
R54  182.88,148.59 180 top
R55  182.88,151.13 180 top
R56  182.88,153.67 180 top
R71  68.58,172.72 0 top
R72  68.58,170.18 0 top
R73  68.58,167.64 0 top
R74  68.58,165.1 0 top
R75  68.58,162.56 0 top
R76  68.58,160.02 0 top
R77  68.58,157.48 0 top
R78  68.58,154.94 0 top
R79  68.58,152.4 0 top
R80  68.58,149.86 0 top
R81  68.58,147.32 0 top
R82  68.58,144.78 0 top
R83  68.58,142.24 0 top
R84  68.58,139.7 0 top
R85  68.58,83.82 0 top
R86  68.58,81.28 0 top
R87  68.58,78.74 0 top
R88  68.58,76.2 0 top
R89  68.58,73.66 0 top
R90  68.58,71.12 0 top
R91  68.58,68.58 0 top
R92  68.58,66.04 0 top
R93  68.58,63.5 0 top
R94  68.58,60.96 0 top
R95  68.58,58.42 0 top
R96  68.58,55.88 0 top
R97  68.58,53.34 0 top
R98  68.58,50.8 0 top
R99  68.58,48.26 0 top
R100  68.58,45.72 0 top
R101  68.58,43.18 0 top
R102  68.58,40.64 0 top
R103  68.58,38.1 0 top
R104  68.58,35.56 0 top
R105  68.58,33.02 0 top
R106  68.58,30.48 0 top
R107  68.58,27.94 0 top
R108  68.58,25.4 0 top
R109  68.58,22.86 0 top
R110  68.58,20.32 0 top
R111  68.58,17.78 0 top
R112  68.58,15.24 0 top
R113  182.88,31.75 180 top
R114  182.88,34.29 180 top
R115  182.88,36.83 180 top
R116  182.88,39.37 180 top
R117  182.88,41.91 180 top
R118  182.88,44.45 180 top
R119  182.88,46.99 180 top
R120  182.88,49.53 180 top
R121  182.88,52.07 180 top
R122  182.88,54.61 180 top
R123  182.88,57.15 180 top
R124  182.88,59.69 180 top
R125  182.88,62.23 180 top
R126  182.88,64.77 180 top
R184  180.34,186.69 0 top
R185  180.34,189.23 0 top
R186  180.34,191.77 0 top

### Tracks (layer width: path | path; a pad name or v marks a point on that pad's centre or on a via)
D(A)  (via drill 0.6)
  Top 0.406: IC24.2 44.45,30.48 44.45,26.67 v15.24,26.67 | IC23.2 v15.24,48.26 | IC21.2 v15.24,83.82 | IC6.2 44.45,101.6 44.45,97.79 v15.24,97.79 | IC22.2 44.45,66.04 44.45,62.23 v15.24,62.23 | IC3.2 v15.24,119.38 | IC1.2 44.45,137.16 44.45,133.35 v15.24,133.35 | IC18.2 v15.24,154.94 | IC9.2 196.85,138.43 196.85,175.26 113.03,175.26 CON6.3
  Bottom 0.406: IC9.2 207.01,138.43 207.01,143.51 220.98,143.51 220.98,120.65 | 220.98,120.65 220.98,107.95 | 220.98,107.95 220.98,85.09 | 220.98,85.09 220.98,72.39 | 220.98,72.39 220.98,49.53 | 220.98,49.53 220.98,31.75 IC25.2 | IC26.2 220.98,49.53 | IC10.2 220.98,85.09 | IC8.2 220.98,120.65 | IC5.2 205.74,67.31 205.74,72.39 220.98,72.39 | IC11.2 205.74,102.87 205.74,107.95 220.98,107.95 | v15.24,26.67 v15.24,48.26 v15.24,62.23 v15.24,83.82 v15.24,97.79 v15.24,119.38 v15.24,133.35 v15.24,154.94 15.24,172.72 46.99,172.72 | IC17.2 46.99,172.72 | 46.99,172.72 46.99,182.88 113.03,182.88 CON6.3
D(B)  (via drill 0.6)
  Top 0.406: v223.52,34.29 IC25.3 | IC26.3 v223.52,52.07 | IC10.3 v223.52,87.63 | IC5.3 205.74,69.85 205.74,72.39 v223.52,72.39 | IC11.3 205.74,105.41 205.74,107.95 v223.52,107.95 | IC8.3 v223.52,123.19 | IC24.3 45.72,27.94 45.72,25.4 v17.78,25.4 | IC23.3 v17.78,45.72 | IC21.3 v17.78,81.28 | IC6.3 45.72,99.06 45.72,96.52 v17.78,96.52 | IC22.3 45.72,63.5 45.72,60.96 v17.78,60.96 | IC3.3 v17.78,116.84 | IC1.3 45.72,134.62 45.72,132.08 v17.78,132.08 | IC18.3 v17.78,152.4 | IC9.3 198.12,140.97 198.12,176.53 114.3,176.53 114.3,189.23 CON6.4
  Bottom 0.406: IC9.3 205.74,140.97 205.74,144.78 223.52,144.78 v223.52,123.19 v223.52,107.95 v223.52,87.63 v223.52,72.39 v223.52,52.07 v223.52,34.29 | v17.78,25.4 v17.78,45.72 v17.78,60.96 v17.78,81.28 v17.78,96.52 v17.78,116.84 v17.78,132.08 v17.78,152.4 17.78,170.18 IC17.3 52.07,170.18 52.07,181.61 114.3,181.61 114.3,189.23 CON6.4
D(C)  (via drill 0.6)
  Top 0.406: v226.06,36.83 IC25.4 | IC26.4 v226.06,54.61 | IC10.4 v226.06,90.17 | IC5.4 204.47,72.39 204.47,73.66 v226.06,73.66 | IC11.4 204.47,107.95 204.47,109.22 v226.06,109.22 | IC8.4 v226.06,125.73 | IC24.4 46.99,25.4 46.99,24.13 v20.32,24.13 | IC23.4 v20.32,43.18 | IC21.4 v20.32,78.74 | IC6.4 46.99,96.52 46.99,95.25 v20.32,95.25 | IC22.4 46.99,60.96 46.99,59.69 v20.32,59.69 | IC3.4 v20.32,114.3 | IC1.4 46.99,132.08 46.99,130.81 v20.32,130.81 | IC18.4 v20.32,149.86 | IC9.4 199.39,143.51 199.39,177.8 115.57,177.8 CON6.5
  Bottom 0.406: IC9.4 204.47,143.51 204.47,146.05 226.06,146.05 v226.06,125.73 v226.06,109.22 v226.06,90.17 v226.06,73.66 v226.06,54.61 v226.06,36.83 | v20.32,24.13 v20.32,43.18 v20.32,59.69 v20.32,78.74 v20.32,95.25 v20.32,114.3 v20.32,130.81 v20.32,149.86 20.32,167.64 IC17.4 53.34,167.64 53.34,180.34 115.57,180.34 CON6.5
D(D)  (via drill 0.6)
  Top 0.406: v228.6,39.37 IC25.5 | IC26.5 v228.6,57.15 | IC10.5 v228.6,92.71 | IC5.5 v228.6,74.93 | IC11.5 v228.6,110.49 | IC8.5 v228.6,128.27 | v22.86,22.86 IC24.5 | IC23.5 v22.86,40.64 | IC21.5 v22.86,76.2 | IC6.5 v22.86,93.98 | IC22.5 v22.86,58.42 | IC3.5 v22.86,111.76 | IC1.5 v22.86,129.54 | IC18.5 v22.86,147.32
  Bottom 0.406: v228.6,39.37 v228.6,57.15 v228.6,74.93 v228.6,92.71 v228.6,110.49 v228.6,128.27 228.6,147.32 203.2,147.32 203.2,146.05 IC9.5 196.85,146.05 196.85,175.26 116.84,175.26 116.84,179.07 | v22.86,22.86 v22.86,40.64 v22.86,58.42 v22.86,76.2 v22.86,93.98 v22.86,111.76 v22.86,129.54 v22.86,147.32 22.86,165.1 IC17.5 54.61,165.1 54.61,179.07 116.84,179.07 | 116.84,179.07 116.84,189.23 CON6.6
D(E)  (via drill 0.6)
  Top 0.406: IC25.6 v231.14,41.91 | IC26.6 v231.14,59.69 | IC10.6 v231.14,95.25 | IC5.6 v231.14,77.47 | IC11.6 v231.14,113.03 | IC8.6 v231.14,130.81 | v25.4,20.32 IC24.6 | IC23.6 v25.4,38.1 | IC21.6 v25.4,73.66 | IC6.6 v25.4,91.44 | IC22.6 v25.4,55.88 | IC3.6 v25.4,109.22 | IC1.6 v25.4,127 | IC18.6 v25.4,144.78 | IC17.6 46.99,162.56 46.99,182.88 109.22,182.88 109.22,191.77 116.84,191.77 116.84,189.23 CON6.7
  Bottom 0.406: v231.14,41.91 v231.14,59.69 v231.14,77.47 v231.14,95.25 v231.14,113.03 v231.14,130.81 231.14,148.59 IC9.6 198.12,148.59 198.12,176.53 118.11,176.53 CON6.7 | IC17.6 25.4,162.56 v25.4,144.78 v25.4,127 v25.4,109.22 v25.4,91.44 v25.4,73.66 v25.4,55.88 v25.4,38.1 v25.4,20.32
D(F)  (via drill 0.6)
  Top 0.406: IC25.7 204.47,44.45 204.47,43.18 227.33,43.18 227.33,44.45 v233.68,44.45 | IC26.7 v233.68,62.23 | IC10.7 v233.68,97.79 | IC5.7 204.47,80.01 204.47,78.74 v233.68,78.74 | IC11.7 204.47,115.57 204.47,114.3 v233.68,114.3 | IC8.7 v233.68,133.35 | v27.94,17.78 IC24.7 | IC23.7 v27.94,35.56 | IC21.7 v27.94,71.12 | IC6.7 v27.94,88.9 | IC22.7 v27.94,53.34 | IC3.7 v27.94,106.68 | IC1.7 v27.94,124.46 | IC18.7 v27.94,142.24 | IC17.7 45.72,160.02 45.72,184.15 107.95,184.15 107.95,193.04 118.11,193.04 CON6.8
  Bottom 0.406: v233.68,44.45 v233.68,62.23 v233.68,78.74 v233.68,97.79 v233.68,114.3 v233.68,133.35 233.68,151.13 IC9.7 199.39,151.13 199.39,177.8 119.38,177.8 119.38,189.23 CON6.8 | IC17.7 45.72,160.02 45.72,161.29 27.94,161.29 v27.94,142.24 v27.94,124.46 v27.94,106.68 v27.94,88.9 v27.94,71.12 v27.94,53.34 v27.94,35.56 v27.94,17.78
D(G)  (via drill 0.6)
  Top 0.406: IC25.8 205.74,46.99 205.74,44.45 226.06,44.45 226.06,46.99 v236.22,46.99 | IC26.8 v236.22,64.77 | IC10.8 v236.22,100.33 | IC5.8 205.74,82.55 205.74,80.01 v236.22,80.01 | IC11.8 205.74,118.11 205.74,115.57 v236.22,115.57 | IC8.8 v236.22,135.89 | IC17.8 44.45,157.48 44.45,185.42 106.68,185.42 106.68,194.31 119.38,194.31 119.38,189.23 CON6.9
  Bottom 0.406: v236.22,46.99 v236.22,64.77 v236.22,80.01 v236.22,100.33 v236.22,115.57 v236.22,135.89 236.22,153.67 204.47,153.67 | IC17.8 44.45,157.48 44.45,160.02 30.48,160.02 30.48,139.7 | 30.48,139.7 30.48,124.46 | 30.48,124.46 30.48,104.14 | 30.48,104.14 30.48,88.9 | 30.48,88.9 30.48,68.58 | 30.48,68.58 30.48,53.34 | 30.48,53.34 30.48,33.02 | 30.48,33.02 30.48,15.24 IC24.8 | IC23.8 30.48,33.02 | IC21.8 30.48,68.58 | IC3.8 30.48,104.14 | IC18.8 30.48,139.7 | IC22.8 44.45,50.8 44.45,53.34 30.48,53.34 | IC6.8 44.45,86.36 44.45,88.9 30.48,88.9 | IC1.8 44.45,121.92 44.45,124.46 30.48,124.46 | IC9.8 204.47,153.67 | 204.47,153.67 204.47,179.07 120.65,179.07 CON6.9
D(SEL)  (12 unrouted)
  Bottom 0.406: IC16.5 207.01,163.83 207.01,168.91 | 207.01,168.91 IC16.3 | 207.01,168.91 207.01,173.99 IC16.1 | IC2.1 220.98,173.99 220.98,168.91 | IC2.3 220.98,168.91 | 220.98,168.91 220.98,163.83 IC2.5
GND  (75 unrouted)
  Top 0.813: IC9.10 204.47,158.75 | 204.47,158.75 IC16.7 209.55,156.21 223.52,156.21 | IC2.7 223.52,156.21 | 223.52,156.21 237.49,156.21 IC7.7 | IC9.1 204.47,135.89 204.47,158.75 | IC17.1 52.07,175.26 52.07,154.94 IC17.9
  Bottom 0.813: IC17.10 IC17.9 | IC1.10 IC1.9 52.07,119.38 52.07,139.7 IC1.1 | IC6.10 IC6.9 52.07,83.82 52.07,104.14 IC6.1 | IC22.10 IC22.9 52.07,48.26 52.07,68.58 IC22.1 | IC24.10 IC24.9 52.07,12.7 52.07,33.02 IC24.1 | IC25.10 IC25.9 199.39,49.53 199.39,29.21 IC25.1 | IC5.10 IC5.9 199.39,85.09 199.39,64.77 IC5.1 | IC11.10 IC11.9 199.39,120.65 199.39,100.33 IC11.1 | IC9.10 IC9.9 | IC8.10 IC8.9 214.63,138.43 214.63,118.11 IC8.1 | IC10.10 IC10.9 214.63,102.87 214.63,82.55 IC10.1 | IC26.10 IC26.9 214.63,67.31 214.63,46.99 IC26.1 | IC18.10 IC18.9 36.83,137.16 36.83,157.48 IC18.1 | IC3.10 IC3.9 36.83,101.6 36.83,121.92 IC3.1 | IC21.10 IC21.9 36.83,66.04 36.83,86.36 IC21.1 | IC23.10 IC23.9 36.83,30.48 36.83,50.8 IC23.1 | LED30.K LED29.K LED28.K 240.03,158.75 IC7.7 | CON6.26 CON6.25 CON6.23 CON6.24
ICOEALU  (2 unrouted)
IFL_C
  Bottom 0.406: R186.1 132.08,191.77 132.08,189.23 CON6.19
IFL_V
  Bottom 0.406: R184.1 179.07,186.69 179.07,194.31 129.54,194.31 129.54,189.23 CON6.17
IFL_Z
  Bottom 0.406: R185.1 177.8,189.23 177.8,193.04 130.81,193.04 CON6.18
ITAC  (2 unrouted)
ITAR1  (2 unrouted)
ITAR2  (2 unrouted)
ITOP  (2 unrouted)
ITRX  (2 unrouted)
ITRY  (1 unrouted)
  Bottom 0.406: IC7.2 234.95,171.45 234.95,163.83 IC7.5
ITSP  (1 unrouted)
  Bottom 0.406: IC7.13 247.65,171.45 247.65,163.83 IC7.10
N$1  (1 unrouted)
N$2  (1 unrouted)
N$3
  Bottom 0.406: R2.2 81.28,134.62 81.28,128.27 104.14,128.27 104.14,114.3 107.95,114.3 LED1.6
N$4
  Bottom 0.406: R1.1 IC1.19
N$5
  Bottom 0.406: IC1.18 R2.1
N$6
  Bottom 0.406: IC1.17 R3.1
N$7
  Bottom 0.406: IC1.16 R4.1
N$8
  Bottom 0.406: IC1.15 R5.1
N$9
  Bottom 0.406: IC1.14 R6.1
N$10
  Bottom 0.406: IC1.13 R7.1
N$11
  Bottom 0.406: R1.2 82.55,137.16 82.55,129.54 105.41,129.54 LED1.7
N$12
  Bottom 0.406: R3.2 80.01,132.08 80.01,127 101.6,127 101.6,101.6 105.41,101.6 LED1.4
N$13
  Bottom 0.406: R4.2 77.47,129.54 77.47,124.46 99.06,124.46 99.06,101.6 100.33,101.6 LED1.2
N$14
  Bottom 0.406: R5.2 74.93,127 74.93,121.92 96.52,121.92 96.52,101.6 97.79,101.6 LED1.1
N$15
  Bottom 0.406: R6.2 69.85,124.46 69.85,130.81 78.74,130.81 78.74,125.73 100.33,125.73 LED1.9
N$16
  Bottom 0.406: R7.2 73.66,121.92 73.66,125.73 71.12,125.73 71.12,128.27 76.2,128.27 76.2,123.19 97.79,123.19 LED1.10
N$17  (1 unrouted)
N$18
  Bottom 0.406: R9.2 71.12,116.84 71.12,120.65 95.25,120.65 LED2.6
N$19
  Bottom 0.406: R8.1 59.69,119.38 59.69,114.3 46.99,114.3 46.99,119.38 IC3.19
N$20
  Bottom 0.406: R9.1 60.96,116.84 60.96,113.03 45.72,113.03 45.72,116.84 IC3.18
N$21
  Bottom 0.406: R10.1 62.23,114.3 62.23,111.76 44.45,111.76 44.45,114.3 IC3.17
N$22
  Bottom 0.406: R11.1 63.5,111.76 63.5,110.49 43.18,110.49 43.18,111.76 IC3.16
N$23
  Bottom 0.406: IC3.15 R12.1
N$24
  Bottom 0.406: R13.1 63.5,106.68 63.5,107.95 44.45,107.95 44.45,106.68 IC3.14
N$25
  Bottom 0.406: R14.1 62.23,104.14 62.23,106.68 45.72,106.68 45.72,104.14 IC3.13
N$26
  Bottom 0.406: R8.2 92.71,119.38 LED2.7
N$27
  Bottom 0.406: R10.2 81.28,114.3 81.28,111.76 92.71,111.76 LED2.4
N$28
  Bottom 0.406: R11.2 80.01,111.76 80.01,110.49 87.63,110.49 LED2.2
N$29
  Bottom 0.406: R12.2 85.09,109.22 LED2.1
N$30
  Bottom 0.406: R13.2 71.12,106.68 71.12,115.57 82.55,115.57 82.55,116.84 87.63,116.84 LED2.9
N$31
  Bottom 0.406: LED2.10 85.09,113.03 93.98,113.03 93.98,99.06 81.28,99.06 81.28,104.14 R14.2
N$32  (1 unrouted)
N$33  (1 unrouted)
N$34  (1 unrouted)
N$35  (1 unrouted)
N$36
  Bottom 0.406: R15.1 IC5.19
N$37
  Bottom 0.406: IC5.18 R16.1
N$38
  Bottom 0.406: R17.1 IC5.17
N$39
  Bottom 0.406: IC5.16 R18.1
N$40
  Bottom 0.406: R19.1 IC5.15
N$41
  Bottom 0.406: IC5.14 R20.1
N$42
  Bottom 0.406: R21.1 IC5.13
N$43  (1 unrouted)
N$44
  Bottom 0.406: R17.2 181.61,72.39 181.61,81.28 166.37,81.28 166.37,92.71 134.62,92.71 LED3.4
N$45
  Bottom 0.406: R18.2 180.34,74.93 180.34,78.74 163.83,78.74 163.83,90.17 129.54,90.17 LED3.2
N$46
  Bottom 0.406: R19.2 162.56,77.47 162.56,88.9 127,88.9 LED3.1
N$47
  Bottom 0.406: R20.2 165.1,80.01 165.1,91.44 133.35,91.44 133.35,116.84 129.54,116.84 LED3.9
N$48
  Bottom 0.406: R21.2 167.64,82.55 167.64,93.98 135.89,93.98 135.89,118.11 127,118.11 LED3.10
N$49  (1 unrouted)
N$50  (1 unrouted)
N$51  (1 unrouted)
N$52
  Bottom 0.406: R44.2 111.76,123.19 111.76,149.86 128.27,149.86 128.27,146.05 137.16,146.05 LED7.6
N$53
  Bottom 0.406: R43.1 191.77,120.65 191.77,125.73 204.47,125.73 204.47,120.65 IC8.19
N$54
  Bottom 0.406: R44.1 190.5,123.19 190.5,127 205.74,127 205.74,123.19 IC8.18
N$55
  Bottom 0.406: R45.1 189.23,125.73 189.23,128.27 207.01,128.27 207.01,125.73 IC8.17
N$56
  Bottom 0.406: R46.1 187.96,128.27 187.96,129.54 208.28,129.54 208.28,128.27 IC8.16
N$57
  Bottom 0.406: R47.1 IC8.15
N$58
  Bottom 0.406: R48.1 187.96,133.35 187.96,132.08 207.01,132.08 207.01,133.35 IC8.14
N$59
  Bottom 0.406: R49.1 191.77,135.89 191.77,133.35 205.74,133.35 205.74,135.89 IC8.13
N$60
  Bottom 0.406: R43.2 180.34,120.65 180.34,132.08 177.8,132.08 177.8,134.62 184.15,134.62 184.15,158.75 134.62,158.75 LED7.7
N$61
  Bottom 0.406: R45.2 123.19,125.73 123.19,134.62 134.62,134.62 LED7.4
N$62
  Bottom 0.406: R46.2 125.73,128.27 125.73,133.35 129.54,133.35 LED7.2
N$63
  Bottom 0.406: R47.2 177.8,130.81 177.8,129.54 127,129.54 LED7.1
N$64
  Bottom 0.406: R48.2 185.42,133.35 185.42,160.02 129.54,160.02 LED7.9
N$65
  Bottom 0.406: R49.2 182.88,135.89 182.88,157.48 151.13,157.48 151.13,144.78 127,144.78 LED7.10
N$66  (1 unrouted)
N$67  (1 unrouted)
N$68  (1 unrouted)
N$69
  Bottom 0.406: R51.2 180.34,140.97 180.34,149.86 156.21,149.86 156.21,139.7 113.03,139.7 113.03,148.59 124.46,148.59 LED8.6
N$70
  Bottom 0.406: R50.1 IC9.19
N$71
  Bottom 0.406: IC9.18 R51.1
N$72
  Bottom 0.406: R52.1 IC9.17
N$73
  Bottom 0.406: IC9.16 R53.1
N$74
  Bottom 0.406: R54.1 IC9.15
N$75
  Bottom 0.406: IC9.14 R55.1
N$76
  Bottom 0.406: R56.1 IC9.13
N$77
  Bottom 0.406: R50.2 181.61,138.43 181.61,156.21 152.4,156.21 152.4,143.51 121.92,143.51 LED8.7
N$78
  Bottom 0.406: R52.2 160.02,143.51 160.02,135.89 121.92,135.89 LED8.4
N$79
  Bottom 0.406: R53.2 158.75,146.05 158.75,137.16 116.84,137.16 LED8.2
N$80
  Bottom 0.406: R54.2 157.48,148.59 157.48,138.43 114.3,138.43 LED8.1
N$81
  Bottom 0.406: R55.2 180.34,151.13 180.34,154.94 153.67,154.94 153.67,142.24 116.84,142.24 LED8.9
N$82
  Bottom 0.406: R56.2 154.94,153.67 154.94,140.97 114.3,140.97 LED8.10
N$83
  Bottom 0.813: 0,0 250.19,0 250.19,200.66 0,200.66 0,0
N$100  (1 unrouted)
N$101  (1 unrouted)
N$102  (1 unrouted)
N$103  (1 unrouted)
N$104
  Bottom 0.406: R85.1 59.69,83.82 59.69,78.74 46.99,78.74 46.99,83.82 IC21.19
N$105
  Bottom 0.406: R86.1 60.96,81.28 60.96,77.47 45.72,77.47 45.72,81.28 IC21.18
N$106
  Bottom 0.406: R87.1 62.23,78.74 62.23,76.2 44.45,76.2 44.45,78.74 IC21.17
N$107
  Bottom 0.406: R88.1 63.5,76.2 63.5,74.93 43.18,74.93 43.18,76.2 IC21.16
N$108
  Bottom 0.406: IC21.15 R89.1
N$109
  Bottom 0.406: R90.1 63.5,71.12 63.5,72.39 44.45,72.39 44.45,71.12 IC21.14
N$110
  Bottom 0.406: R91.1 62.23,68.58 62.23,71.12 45.72,71.12 45.72,68.58 IC21.13
N$111
  Bottom 0.406: R85.2 82.55,83.82 82.55,81.28 96.52,81.28 96.52,85.09 105.41,85.09 LED13.7
N$112
  Bottom 0.406: LED13.4 105.41,76.2 77.47,76.2 77.47,78.74 R87.2
N$113
  Bottom 0.406: LED13.2 100.33,74.93 76.2,74.93 76.2,76.2 R88.2
N$114
  Bottom 0.406: R89.2 97.79,73.66 LED13.1
N$115
  Bottom 0.406: R90.2 71.12,71.12 71.12,80.01 78.74,80.01 78.74,77.47 100.33,77.47 LED13.9
N$116
  Bottom 0.406: R91.2 69.85,68.58 69.85,82.55 81.28,82.55 81.28,80.01 97.79,80.01 LED13.10
N$117  (1 unrouted)
N$118  (1 unrouted)
N$119  (1 unrouted)
N$120
  Bottom 0.406: R93.2 77.47,63.5 77.47,71.12 93.98,71.12 93.98,67.31 109.22,67.31 109.22,86.36 95.25,86.36 LED14.6
N$121
  Bottom 0.406: IC22.19 R92.1
N$122
  Bottom 0.406: IC22.18 R93.1
N$123
  Bottom 0.406: IC22.17 R94.1
N$124
  Bottom 0.406: R95.1 IC22.16
N$125
  Bottom 0.406: IC22.15 R96.1
N$126
  Bottom 0.406: R97.1 IC22.14
N$127
  Bottom 0.406: IC22.13 R98.1
N$128
  Bottom 0.406: R92.2 68.58,66.04 68.58,85.09 83.82,85.09 83.82,82.55 92.71,82.55 LED14.7
N$129
  Bottom 0.406: R94.2 78.74,60.96 78.74,69.85 92.71,69.85 LED14.4
N$130
  Bottom 0.406: R95.2 81.28,58.42 81.28,67.31 87.63,67.31 LED14.2
N$131
  Bottom 0.406: R96.2 71.12,55.88 71.12,59.69 80.01,59.69 80.01,68.58 LED14.1
N$132
  Bottom 0.406: R97.2 82.55,53.34 82.55,66.04 110.49,66.04 110.49,87.63 87.63,87.63 LED14.9
N$133
  Bottom 0.406: R98.2 83.82,50.8 83.82,64.77 111.76,64.77 111.76,88.9 85.09,88.9 LED14.10
N$134  (1 unrouted)
N$135  (1 unrouted)
N$136  (1 unrouted)
N$137
  Bottom 0.406: R100.2 99.06,45.72 99.06,52.07 107.95,52.07 LED15.6
N$138
  Bottom 0.406: R99.1 59.69,48.26 59.69,43.18 46.99,43.18 46.99,48.26 IC23.19
N$139
  Bottom 0.406: R100.1 60.96,45.72 60.96,41.91 45.72,41.91 45.72,45.72 IC23.18
N$140
  Bottom 0.406: R101.1 62.23,43.18 62.23,40.64 44.45,40.64 44.45,43.18 IC23.17
N$141
  Bottom 0.406: IC23.16 43.18,40.64 43.18,39.37 63.5,39.37 63.5,40.64 R102.1
N$142
  Bottom 0.406: IC23.15 R103.1
N$143
  Bottom 0.406: R104.1 63.5,35.56 63.5,36.83 44.45,36.83 44.45,35.56 IC23.14
N$144
  Bottom 0.406: R105.1 62.23,33.02 62.23,35.56 45.72,35.56 45.72,33.02 IC23.13
N$145
  Bottom 0.406: R99.2 96.52,48.26 96.52,53.34 109.22,53.34 109.22,49.53 105.41,49.53 LED15.7
N$146
  Bottom 0.406: R101.2 105.41,43.18 LED15.4
N$147
  Bottom 0.406: R102.2 100.33,40.64 LED15.2
N$148
  Bottom 0.406: LED15.1 97.79,39.37 81.28,39.37 81.28,38.1 R103.2
N$149
  Bottom 0.406: LED15.9 100.33,44.45 71.12,44.45 71.12,35.56 R104.2
N$150
  Bottom 0.406: R105.2 69.85,33.02 69.85,46.99 97.79,46.99 LED15.10
N$151  (1 unrouted)
N$152  (1 unrouted)
N$153  (1 unrouted)
N$154
  Bottom 0.406: R23.2 77.47,99.06 77.47,95.25 111.76,95.25 111.76,111.76 124.46,111.76 LED4.6
N$155
  Bottom 0.406: IC6.19 R22.1
N$156
  Bottom 0.406: IC6.18 R23.1
N$157
  Bottom 0.406: R24.1 IC6.17
N$158
  Bottom 0.406: IC6.16 R25.1
N$159
  Bottom 0.406: R26.1 IC6.15
N$160
  Bottom 0.406: IC6.14 R27.1
N$161
  Bottom 0.406: R28.1 IC6.13
N$162
  Bottom 0.406: R22.2 78.74,101.6 78.74,96.52 110.49,96.52 110.49,113.03 121.92,113.03 LED4.7
N$163
  Bottom 0.406: R24.2 74.93,96.52 74.93,92.71 121.92,92.71 LED4.4
N$164
  Bottom 0.406: LED4.2 116.84,101.6 123.19,101.6 123.19,91.44 73.66,91.44 73.66,93.98 R25.2
N$165
  Bottom 0.406: R26.2 71.12,91.44 71.12,97.79 76.2,97.79 76.2,93.98 114.3,93.98 LED4.1
N$166
  Bottom 0.406: LED4.9 116.84,114.3 109.22,114.3 109.22,97.79 80.01,97.79 80.01,102.87 69.85,102.87 69.85,88.9 R27.2
N$167
  Bottom 0.406: R28.2 73.66,86.36 73.66,90.17 125.73,90.17 125.73,116.84 114.3,116.84 LED4.10
N$168
  Bottom 0.406: R30.2 168.91,87.63 168.91,95.25 138.43,95.25 138.43,121.92 166.37,121.92 LED5.6
N$169
  Bottom 0.406: R29.1 191.77,85.09 191.77,90.17 204.47,90.17 204.47,85.09 IC10.19
N$170
  Bottom 0.406: R30.1 190.5,87.63 190.5,91.44 205.74,91.44 205.74,87.63 IC10.18
N$171
  Bottom 0.406: R31.1 189.23,90.17 189.23,92.71 207.01,92.71 207.01,90.17 IC10.17
N$172
  Bottom 0.406: R32.1 187.96,92.71 187.96,93.98 208.28,93.98 208.28,92.71 IC10.16
N$173
  Bottom 0.406: R33.1 IC10.15
N$174
  Bottom 0.406: R34.1 187.96,97.79 187.96,96.52 207.01,96.52 207.01,97.79 IC10.14
N$175
  Bottom 0.406: R35.1 189.23,100.33 189.23,97.79 205.74,97.79 205.74,100.33 IC10.13
N$176
  Bottom 0.406: R29.2 180.34,85.09 180.34,88.9 170.18,88.9 170.18,96.52 139.7,96.52 139.7,120.65 163.83,120.65 LED5.7
N$177
  Bottom 0.406: R31.2 171.45,90.17 171.45,101.6 163.83,101.6 LED5.4
N$178
  Bottom 0.406: R32.2 172.72,92.71 172.72,102.87 158.75,102.87 LED5.2
N$179
  Bottom 0.406: R33.2 173.99,95.25 173.99,104.14 156.21,104.14 LED5.1
N$180
  Bottom 0.406: R34.2 175.26,97.79 175.26,105.41 154.94,105.41 154.94,97.79 140.97,97.79 140.97,119.38 158.75,119.38 LED5.9
N$181  (1 unrouted)
N$182
  Bottom 0.406: R37.2 180.34,105.41 180.34,119.38 167.64,119.38 167.64,114.3 157.48,114.3 157.48,116.84 153.67,116.84 LED6.6
N$183
  Bottom 0.406: IC11.19 R36.1
N$184
  Bottom 0.406: R37.1 IC11.18
N$185
  Bottom 0.406: IC11.17 R38.1
N$186
  Bottom 0.406: R39.1 IC11.16
N$187
  Bottom 0.406: IC11.15 R40.1
N$188
  Bottom 0.406: R41.1 IC11.14
N$189
  Bottom 0.406: IC11.13 R42.1
N$190
  Bottom 0.406: R36.2 177.8,102.87 177.8,106.68 152.4,106.68 152.4,99.06 142.24,99.06 142.24,118.11 151.13,118.11 LED6.7
N$191
  Bottom 0.406: R38.2 151.13,107.95 LED6.4
N$192
  Bottom 0.406: R39.2 172.72,110.49 172.72,109.22 146.05,109.22 LED6.2
N$193
  Bottom 0.406: R40.2 171.45,113.03 171.45,110.49 143.51,110.49 LED6.1
N$194
  Bottom 0.406: R41.2 170.18,115.57 170.18,111.76 146.05,111.76 LED6.9
N$195
  Bottom 0.406: R42.2 168.91,118.11 168.91,113.03 147.32,113.03 147.32,116.84 143.51,116.84 LED6.10
N$210
  Bottom 0.406: R72.2 104.14,170.18 104.14,146.05 107.95,146.05 LED11.6
N$211
  Bottom 0.406: IC17.19 R71.1
N$212
  Bottom 0.406: IC17.18 R72.1
N$213
  Bottom 0.406: R73.1 IC17.17
N$214
  Bottom 0.406: R74.1 IC17.16
N$215
  Bottom 0.406: R75.1 IC17.15
N$216
  Bottom 0.406: R76.1 IC17.14
N$217
  Bottom 0.406: IC17.13 R77.1
N$218
  Bottom 0.406: R71.2 105.41,172.72 LED11.7
N$219
  Bottom 0.406: R73.2 101.6,167.64 101.6,133.35 105.41,133.35 LED11.4
N$220
  Bottom 0.406: R74.2 99.06,165.1 99.06,133.35 100.33,133.35 LED11.2
N$221
  Bottom 0.406: R75.2 96.52,162.56 96.52,133.35 97.79,133.35 LED11.1
N$222
  Bottom 0.406: R76.2 69.85,160.02 69.85,166.37 100.33,166.37 LED11.9
N$223
  Bottom 0.406: R77.2 73.66,157.48 73.66,161.29 71.12,161.29 71.12,163.83 97.79,163.83 LED11.10
N$224
  Bottom 0.406: R79.2 91.44,152.4 91.44,146.05 95.25,146.05 LED12.6
N$225
  Bottom 0.406: R78.1 59.69,154.94 59.69,149.86 46.99,149.86 46.99,154.94 IC18.19
N$226
  Bottom 0.406: R79.1 60.96,152.4 60.96,148.59 45.72,148.59 45.72,152.4 IC18.18
N$227
  Bottom 0.406: R80.1 62.23,149.86 62.23,147.32 44.45,147.32 44.45,149.86 IC18.17
N$228
  Bottom 0.406: IC18.16 43.18,147.32 43.18,146.05 63.5,146.05 63.5,147.32 R81.1
N$229
  Bottom 0.406: R82.1 IC18.15
N$230
  Bottom 0.406: IC18.14 44.45,142.24 44.45,143.51 63.5,143.51 63.5,142.24 R83.1
N$231
  Bottom 0.406: R84.1 62.23,139.7 62.23,142.24 45.72,142.24 45.72,139.7 IC18.13
N$232
  Bottom 0.406: R78.2 92.71,154.94 LED12.7
N$233
  Bottom 0.406: LED12.4 92.71,133.35 88.9,133.35 88.9,151.13 73.66,151.13 73.66,149.86 R80.2
N$234
  Bottom 0.406: LED12.2 87.63,133.35 86.36,133.35 86.36,148.59 76.2,148.59 76.2,147.32 R81.2
N$235
  Bottom 0.406: R82.2 85.09,144.78 LED12.1
N$236
  Bottom 0.406: R83.2 69.85,142.24 69.85,148.59 74.93,148.59 74.93,149.86 87.63,149.86 LED12.9
N$237
  Bottom 0.406: R84.2 73.66,139.7 73.66,143.51 71.12,143.51 71.12,146.05 85.09,146.05 LED12.10
N$238
  Bottom 0.406: R107.2 82.55,27.94 82.55,38.1 93.98,38.1 93.98,34.29 110.49,34.29 110.49,54.61 95.25,54.61 LED16.6
N$239
  Bottom 0.406: IC24.19 R106.1
N$240
  Bottom 0.406: R107.1 IC24.18
N$241
  Bottom 0.406: IC24.17 R108.1
N$242
  Bottom 0.406: R109.1 IC24.16
N$243
  Bottom 0.406: IC24.15 R110.1
N$244
  Bottom 0.406: R111.1 IC24.14
N$245
  Bottom 0.406: IC24.13 R112.1
N$246
  Bottom 0.406: R106.2 68.58,30.48 68.58,49.53 92.71,49.53 LED16.7
N$247
  Bottom 0.406: R108.2 83.82,25.4 83.82,36.83 92.71,36.83 LED16.4
N$248
  Bottom 0.406: R109.2 87.63,22.86 LED16.2
N$249
  Bottom 0.406: R110.2 71.12,20.32 71.12,24.13 85.09,24.13 LED16.1
N$250
  Bottom 0.406: R111.2 88.9,17.78 88.9,33.02 111.76,33.02 111.76,55.88 87.63,55.88 LED16.9
N$251
  Bottom 0.406: R112.2 90.17,15.24 90.17,31.75 113.03,31.75 113.03,57.15 85.09,57.15 LED16.10
N$252
  Bottom 0.406: LED17.6 143.51,67.31 143.51,34.29 R114.2
N$253
  Bottom 0.406: R113.1 IC25.19
N$254
  Bottom 0.406: IC25.18 R114.1
N$255
  Bottom 0.406: R115.1 IC25.17
N$256
  Bottom 0.406: R116.1 IC25.16
N$257
  Bottom 0.406: IC25.15 R117.1
N$258
  Bottom 0.406: R118.1 IC25.14
N$259
  Bottom 0.406: IC25.13 R119.1
N$260
  Bottom 0.406: R113.2 142.24,31.75 142.24,66.04 134.62,66.04 LED17.7
N$261
  Bottom 0.406: R115.2 144.78,36.83 144.78,68.58 133.35,68.58 133.35,54.61 134.62,54.61 LED17.4
N$262
  Bottom 0.406: LED17.2 129.54,30.48 180.34,30.48 180.34,39.37 R116.2
N$263
  Bottom 0.406: LED17.1 127,29.21 181.61,29.21 181.61,41.91 R117.2
N$264
  Bottom 0.406: LED17.9 129.54,69.85 146.05,69.85 146.05,44.45 R118.2
N$265
  Bottom 0.406: LED17.10 127,71.12 147.32,71.12 147.32,46.99 R119.2
N$266
  Bottom 0.406: LED18.6 124.46,72.39 148.59,72.39 148.59,52.07 R121.2
N$267
  Bottom 0.406: R120.1 191.77,49.53 191.77,54.61 204.47,54.61 204.47,49.53 IC26.19
N$268
  Bottom 0.406: R121.1 190.5,52.07 190.5,55.88 205.74,55.88 205.74,52.07 IC26.18
N$269
  Bottom 0.406: R122.1 189.23,54.61 189.23,57.15 207.01,57.15 207.01,54.61 IC26.17
N$270
  Bottom 0.406: R123.1 187.96,57.15 187.96,58.42 208.28,58.42 208.28,57.15 IC26.16
N$271
  Bottom 0.406: R124.1 IC26.15
N$272
  Bottom 0.406: R125.1 187.96,62.23 187.96,60.96 207.01,60.96 207.01,62.23 IC26.14
N$273
  Bottom 0.406: R126.1 189.23,64.77 189.23,62.23 205.74,62.23 205.74,64.77 IC26.13
N$274
  Bottom 0.406: LED18.7 121.92,73.66 149.86,73.66 149.86,53.34 180.34,53.34 180.34,49.53 R120.2
N$275
  Bottom 0.406: LED18.4 121.92,27.94 182.88,27.94 182.88,54.61 R122.2
N$276
  Bottom 0.406: LED18.2 116.84,26.67 184.15,26.67 184.15,57.15 R123.2
N$277
  Bottom 0.406: LED18.1 114.3,25.4 185.42,25.4 185.42,59.69 R124.2
N$278
  Bottom 0.406: LED18.9 116.84,74.93 151.13,74.93 151.13,62.23 R125.2
N$279
  Bottom 0.406: LED18.10 114.3,76.2 152.4,76.2 152.4,64.77 R126.2
N$406
  Bottom 0.406: R184.2 181.61,186.69 181.61,194.31 240.03,194.31 LED28.A
N$407
  Bottom 0.406: R185.2 182.88,189.23 182.88,193.04 219.71,193.04 LED29.A
N$408
  Bottom 0.406: R186.2 198.12,191.77 LED30.A
VCC  (46 unrouted)
  Bottom 0.813: CON6.1 CON6.2

### Text on the board
Top: Carry | Zero | Sign | OP Code | Stack Pointer | Accu | X-Reg | Y-Reg | AR1 | ALU | AR2